# EasyEDA Pro project Altium_Scanning Tunneling Microscope_2023-11-04.eprj

# Schematic 1_ADC

## Sheets
1 1_ADC
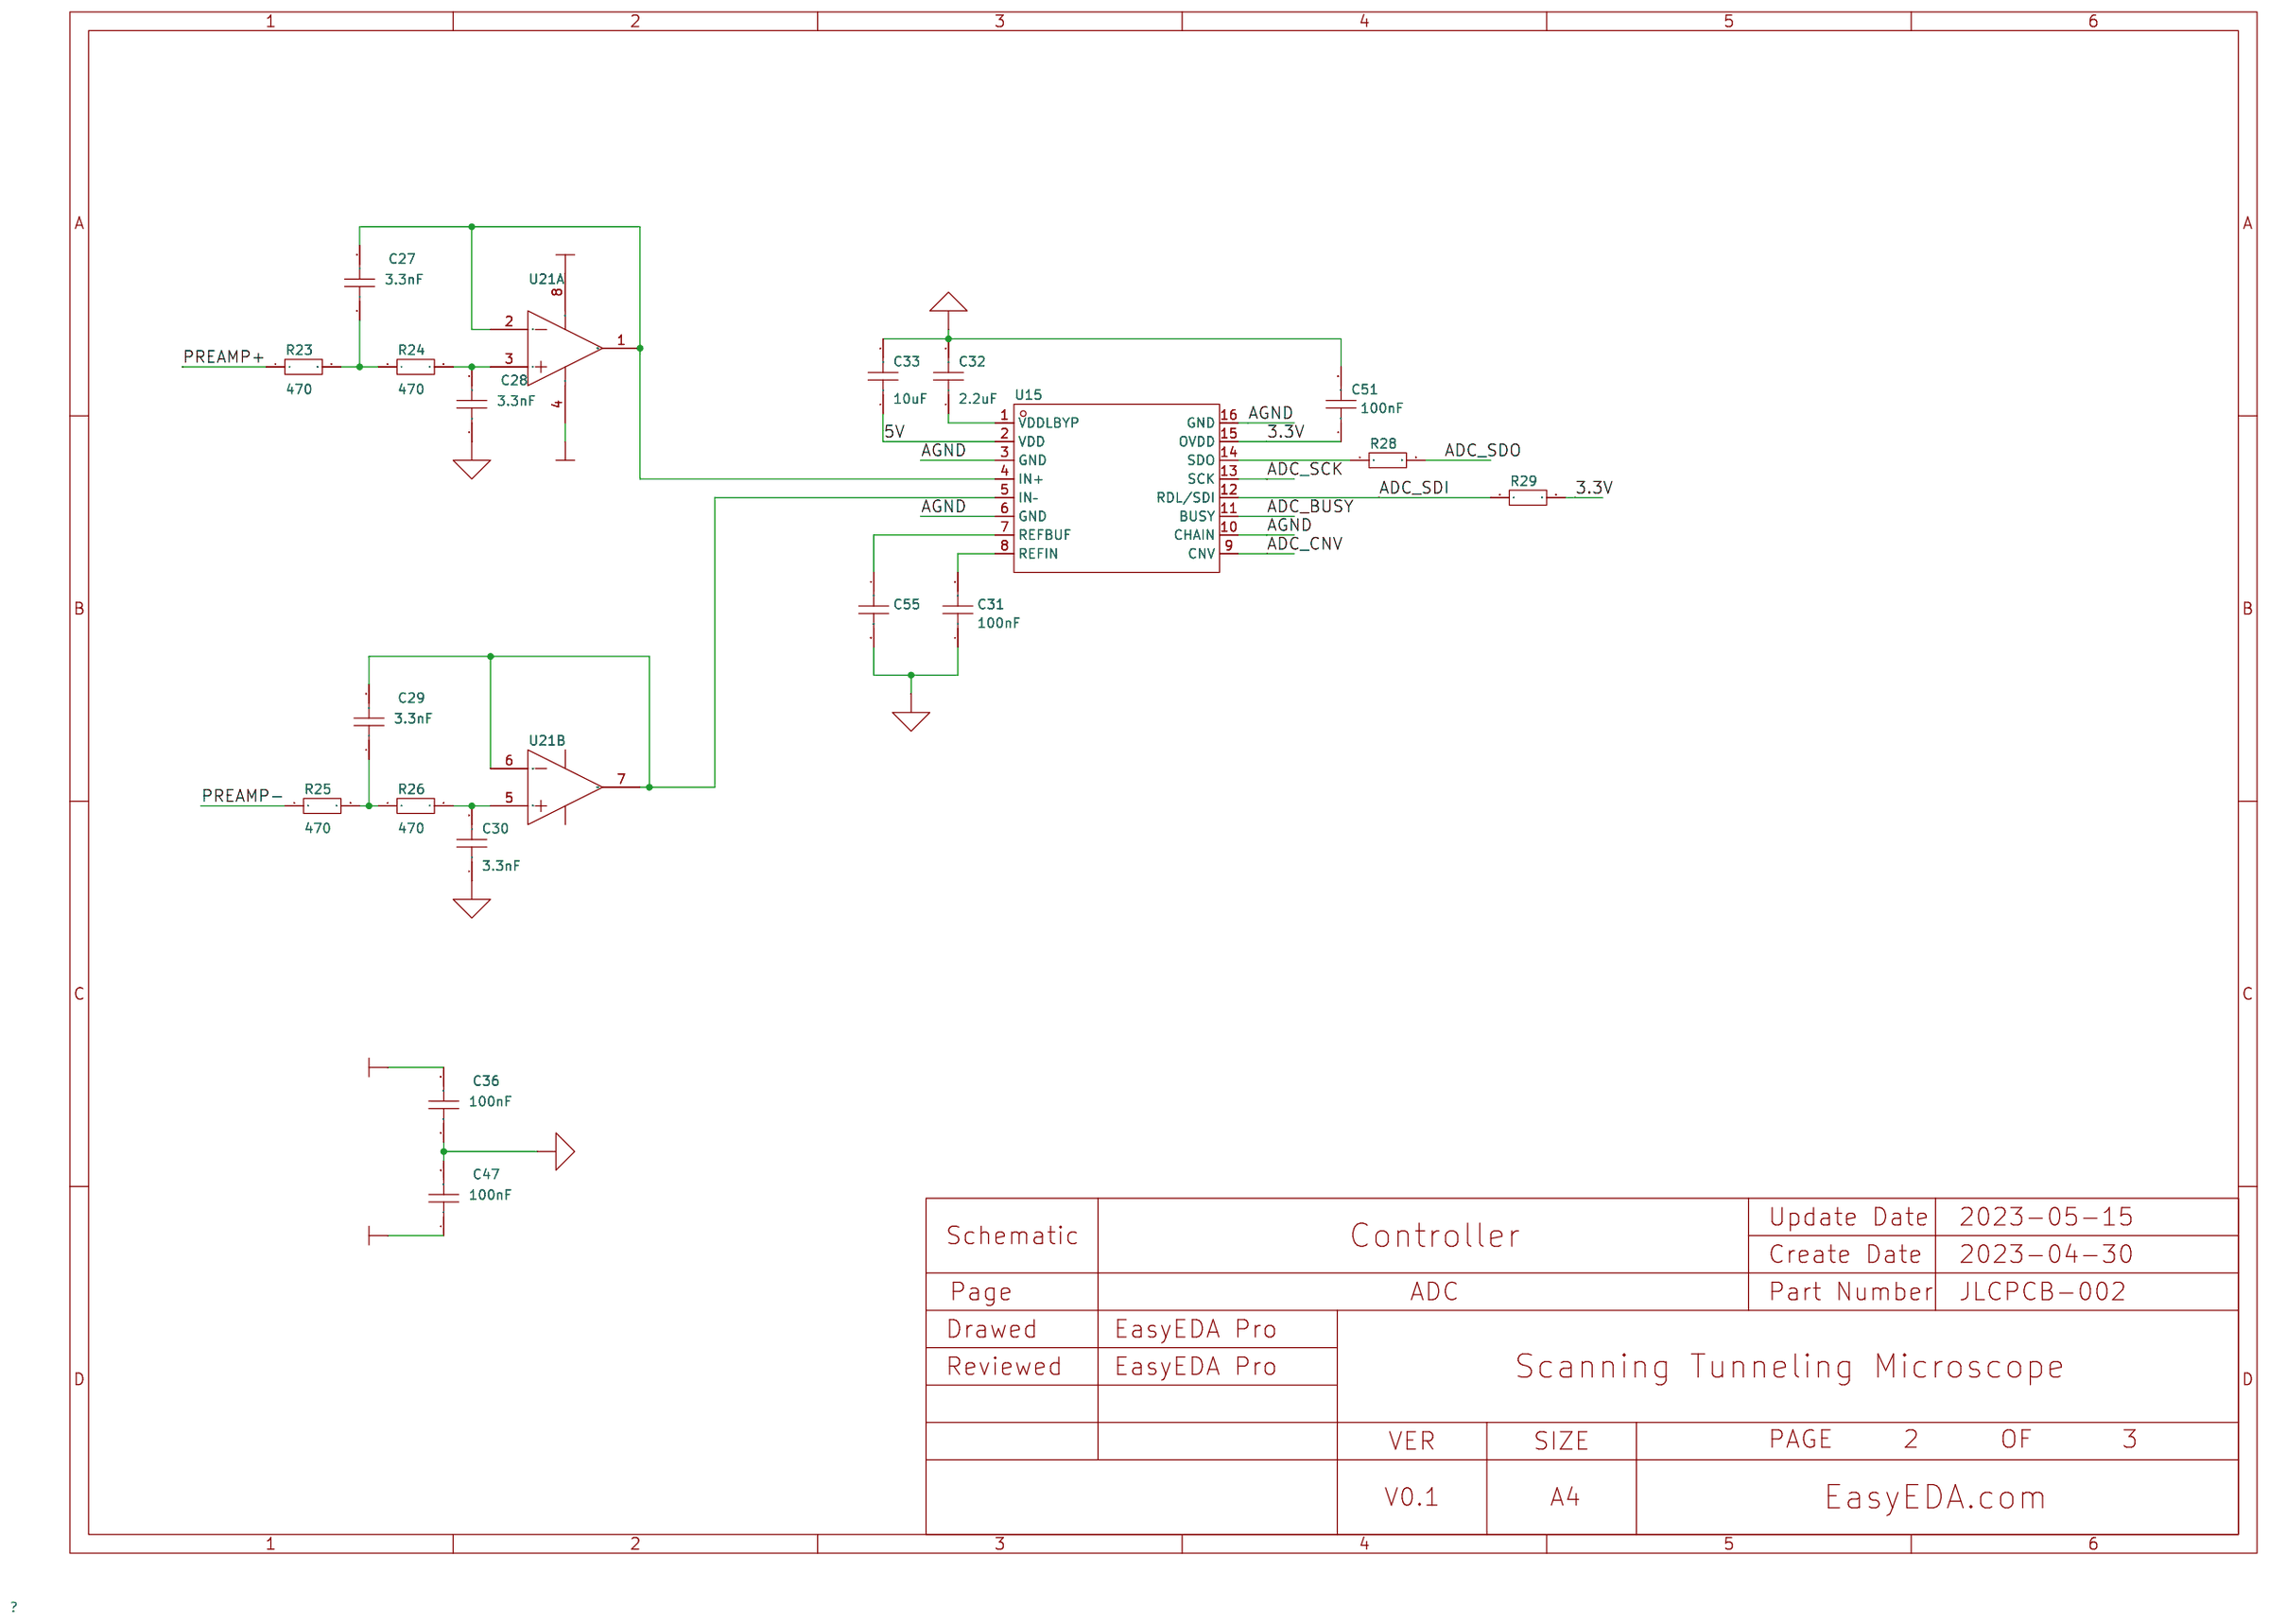
[diagram p0: 1_ADC]
2 2_Connectors
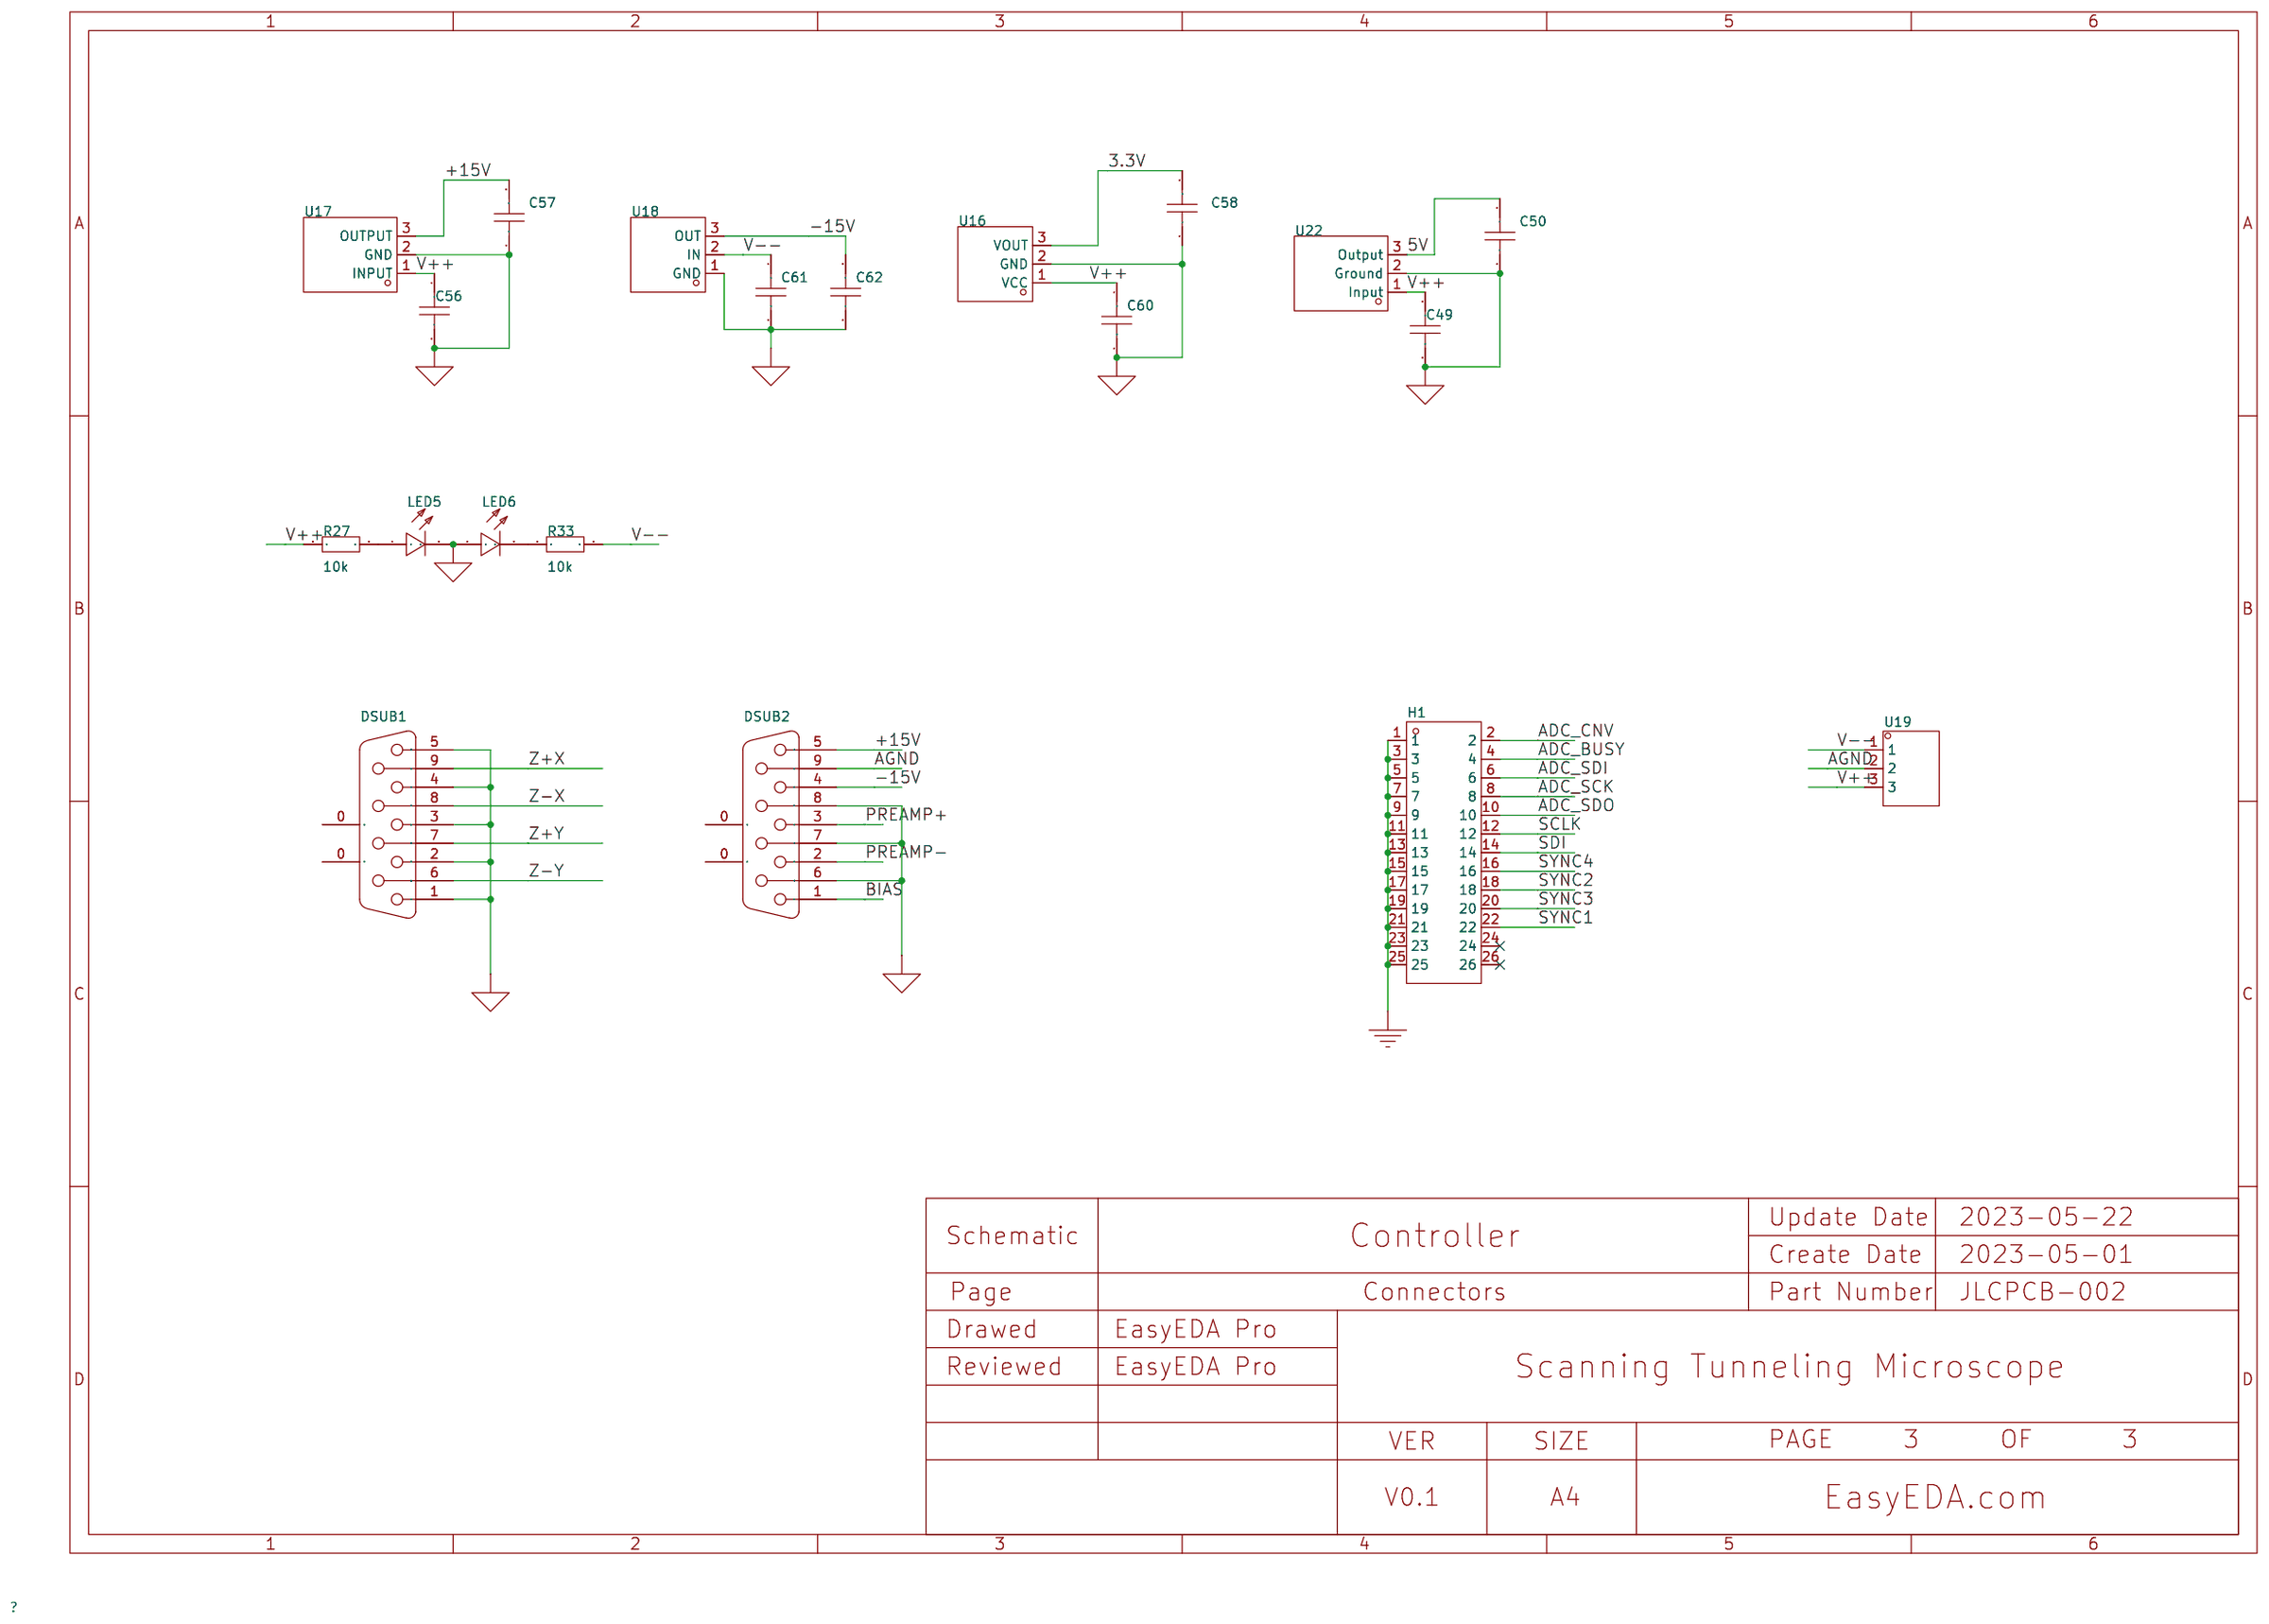
[diagram p1: 2_Connectors]
3 3_DAC
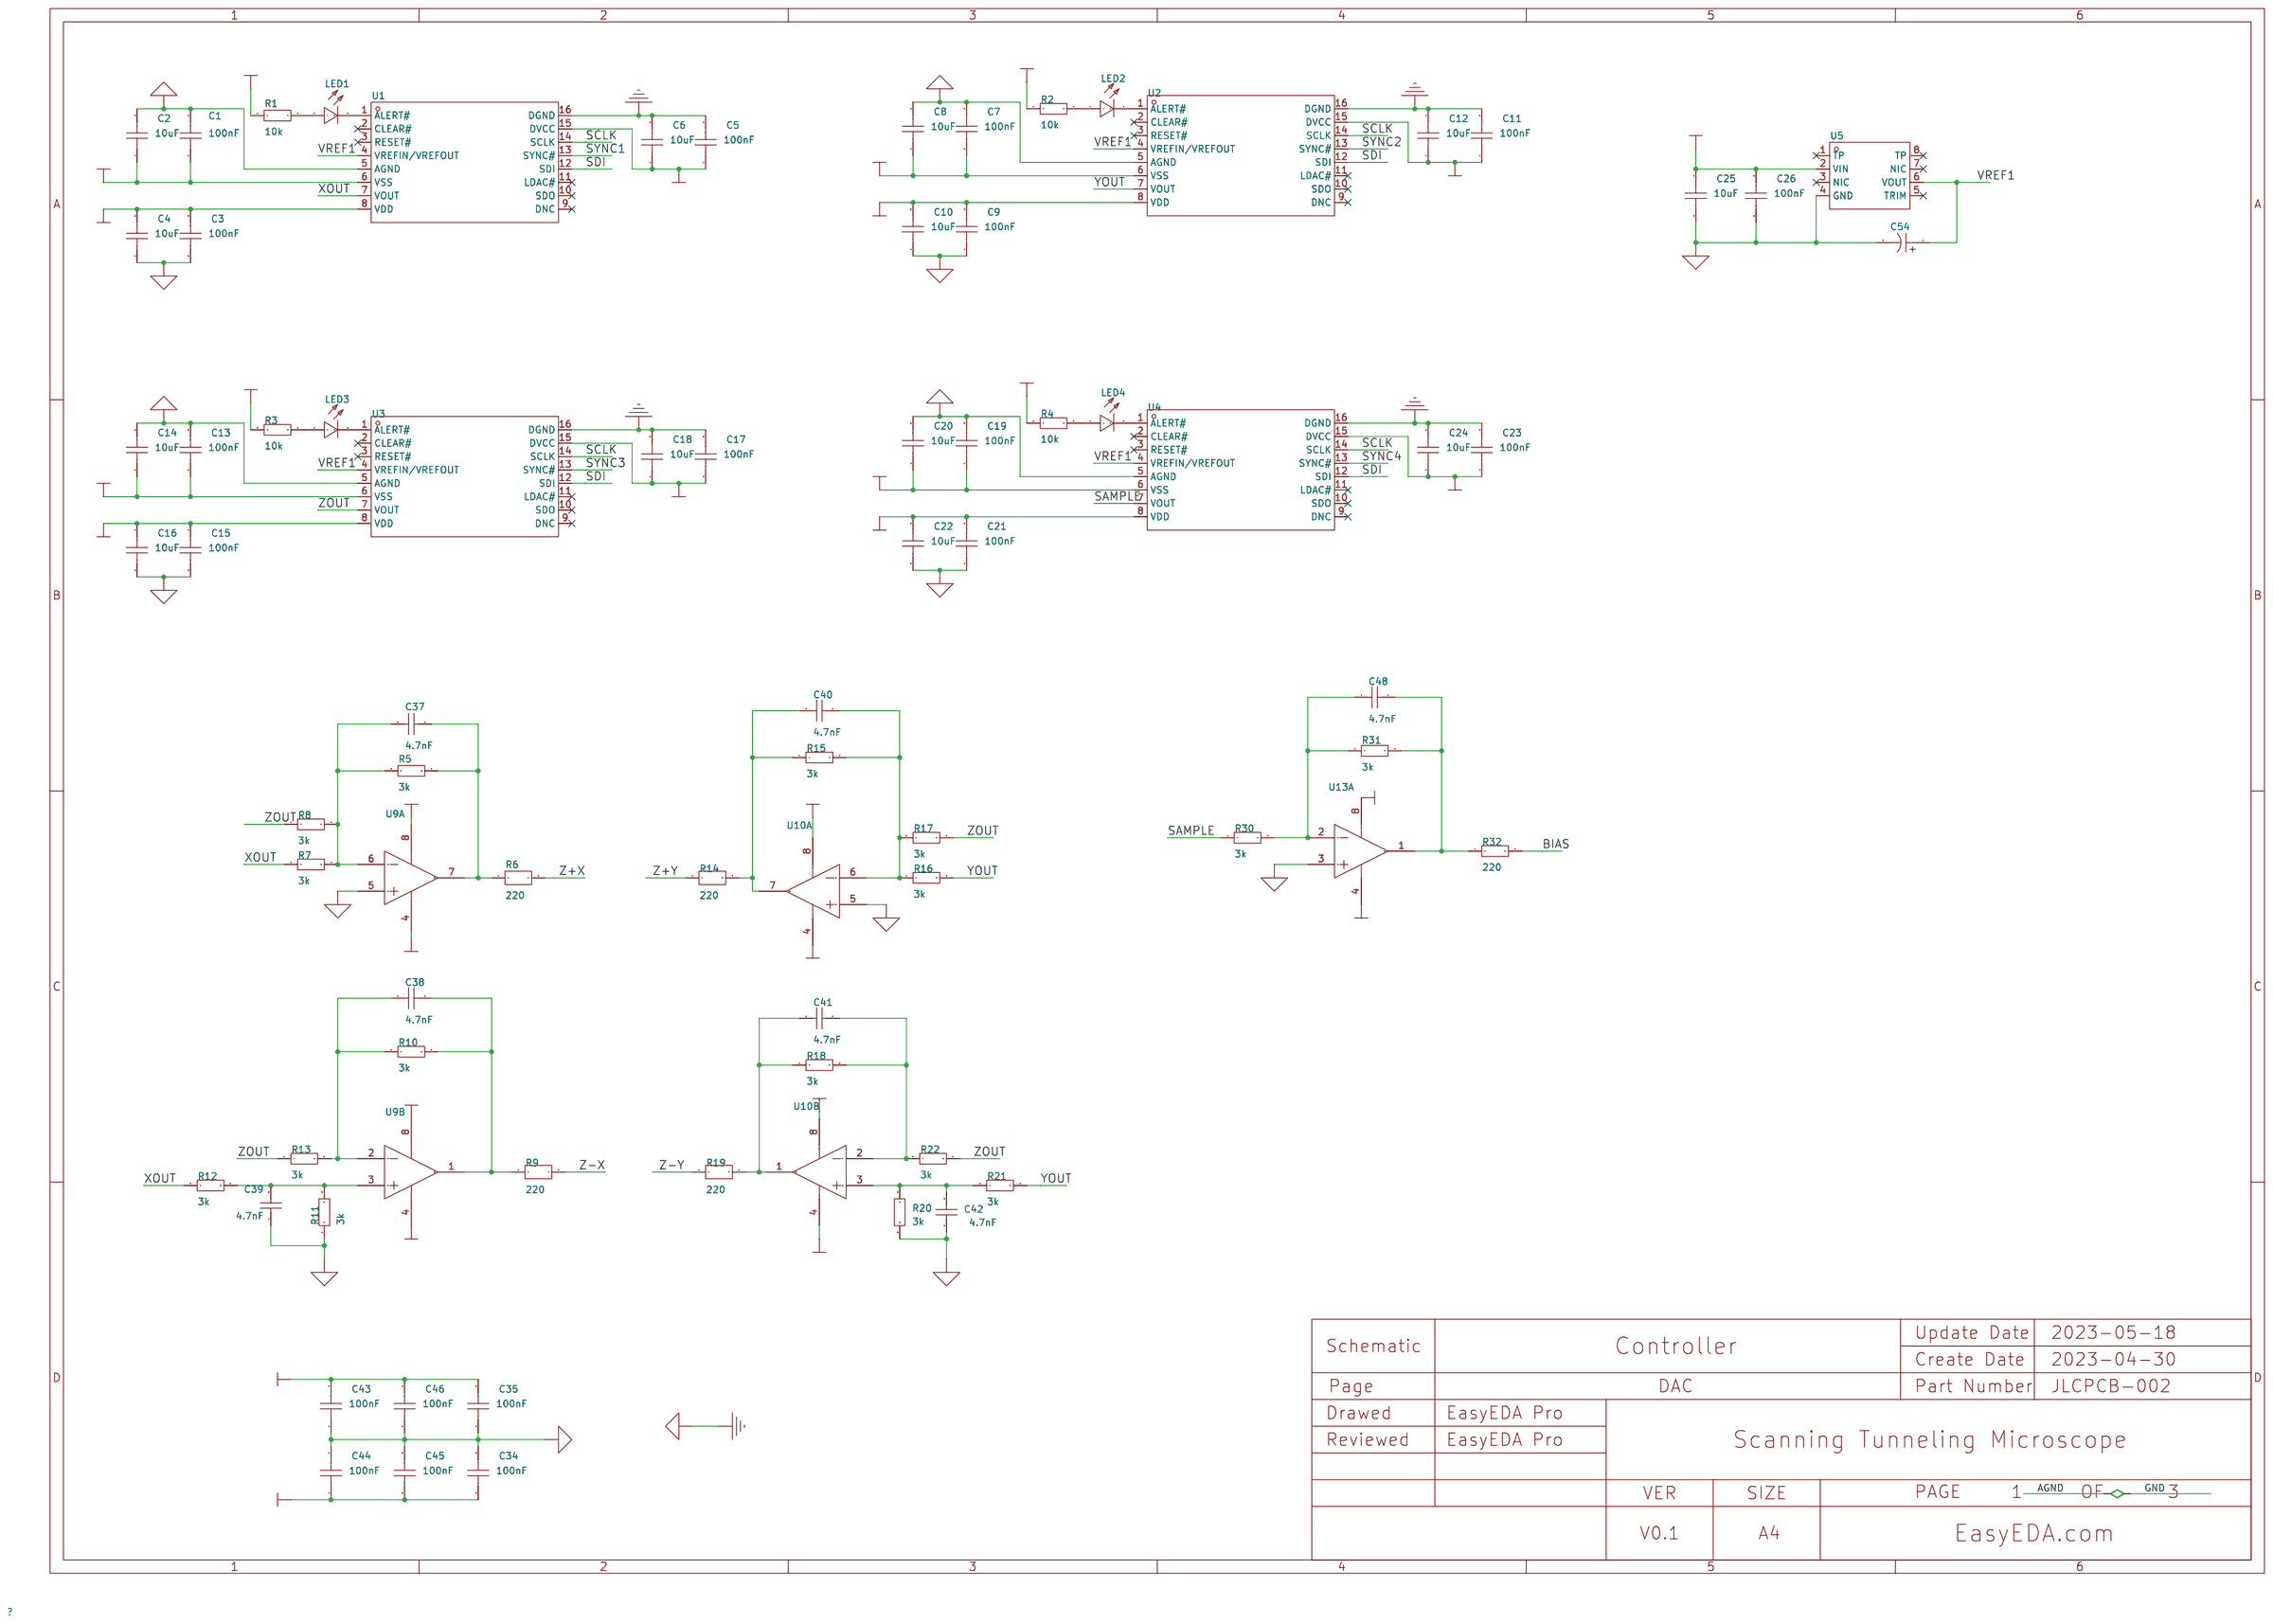
[diagram p2: 3_DAC]

## Parts
sheet 1_ADC
C27  3.3nF  [C0603]
C28  3.3nF  [C0603]
C29  3.3nF  [C0603]
C30  3.3nF  [C0603]
C31  100nF  [C0603]
C32  2.2uF  [C0603]
C33  10uF  [C0603]
C36  100nF  [C0603]
C47  100nF  [C0603]
C51  100nF  [C0603]
C55  47uF  [C1210]
R23  470  [R0603]
R24  470  [R0603]
R25  470  [R0603]
R26  470  [R0603]
R28  100  [R0603]
R29  10K  [R0603]
U15  LTC2326HMS-16#PBF  [MSOP-16_L4.0-W3.0-P0.50-LS4.9-BL]
U21  LT1469IN8#PBF  (sections 1,2)
sheet 2_Connectors
C49  0.33uF  [C0603]
C50  100nF  [C0603]
C56  0.33uF  [C0603]
C57  100nF  [C0603]
C58  1uF  [C0603]
C60  4.7uF  [C0603]
C61  2.2uF  [C0603]
C62  1uF  [C0603]
DSUB1  RDED-9SE-LNA(4-40)(55)  [DSUB-TH_9P-P2.74-S2.84_L18.5-W30.8-M]
DSUB2  RDED-9SE-LNA(4-40)(55)  [DSUB-TH_9P-P2.74-S2.84_L18.5-W30.8-M]
H1  10897262  [HDR-TH_26P-P2.54-V-M-R2-C13-S2.54]
LED5  19-217/R6C-AL1M2VY/3T  [LED0603-R-RD]
LED6  19-217/R6C-AL1M2VY/3T  [LED0603-R-RD]
R27  10k  [R0603]
R33  10k  [R0603]
U16  BD733L5FP-CE2  [TO-252-3L_L6.6-W6.1-P4.60-LS9.5-BR-CW]
U17  SL7815  [TO-220-3_L10.0-W4.5-P2.54-L]
U18  L7915CV  [TO-220-3_L10.0-W4.5-P2.54-L]
U19  B3B-XH-AM(LF)(SN)  [CONN-TH_3P-P2.50_B3B-XH-AM-LF-SN]
U22  MC7805CDTG  [DPAK_L6.6-W6.2-P2.29-LS9.7-BR]
sheet 3_DAC
C1  100nF  [C0603]
C2  10uF  [C0603]
C3  100nF  [C0603]
C4  10uF  [C0603]
C5  100nF  [C0603]
C6  10uF  [C0603]
C7  100nF  [C0603]
C8  10uF  [C0603]
C9  100nF  [C0603]
C10  10uF  [C0603]
C11  100nF  [C0603]
C12  10uF  [C0603]
C13  100nF  [C0603]
C14  10uF  [C0603]
C15  100nF  [C0603]
C16  10uF  [C0603]
C17  100nF  [C0603]
C18  10uF  [C0603]
C19  100nF  [C0603]
C20  10uF  [C0603]
C21  100nF  [C0603]
C22  10uF  [C0603]
C23  100nF  [C0603]
C24  10uF  [C0603]
C25  10uF  [C0603]
C26  100nF  [C0603]
C34  100nF  [C0603]
C35  100nF  [C0603]
C37  4.7nF  [C0603]
C38  4.7nF  [C0603]
C39  4.7nF  [C0603]
C40  4.7nF  [C0603]
C41  4.7nF  [C0603]
C42  4.7nF  [C0603]
C43  100nF  [C0603]
C44  100nF  [C0603]
C45  100nF  [C0603]
C46  100nF  [C0603]
C48  4.7nF  [C0603]
C54  100uF  [CAP-SMD_L7.3-W4.3-FD]
LED1  19-217/R6C-AL1M2VY/3T  [LED0603-R-RD]
LED2  19-217/R6C-AL1M2VY/3T  [LED0603-R-RD]
LED3  19-217/R6C-AL1M2VY/3T  [LED0603-R-RD]
LED4  19-217/R6C-AL1M2VY/3T  [LED0603-R-RD]
R1  10k  [R0603]
R2  10k  [R0603]
R3  10k  [R0603]
R4  10k  [R0603]
R5  3k  [R0603]
R6  220  [R0603]
R7  3k  [R0603]
R8  3k  [R0603]
R9  220  [R0603]
R10  3k  [R0603]
R11  3k  [R0603]
R12  3k  [R0603]
R13  3k  [R0603]
R14  220  [R0603]
R15  3k  [R0603]
R16  3k  [R0603]
R17  3k  [R0603]
R18  3k  [R0603]
R19  220  [R0603]
R20  3k  [R0603]
R21  3k  [R0603]
R22  3k  [R0603]
R30  3k  [R0603]
R31  3k  [R0603]
R32  220  [R0603]
U1  AD5761RBRUZ  [TSSOP-16_L5.0-W4.4-P0.65-LS6.4-TL]
U2  AD5761RBRUZ  [TSSOP-16_L5.0-W4.4-P0.65-LS6.4-TL]
U3  AD5761RBRUZ  [TSSOP-16_L5.0-W4.4-P0.65-LS6.4-TL]
U4  AD5761RBRUZ  [TSSOP-16_L5.0-W4.4-P0.65-LS6.4-TL]
U5  ADR421BRZ-REEL  [SOIC-8_L4.9-W3.9-P1.27-LS6.0-BL]
U9  OPA2227P  (sections 1,2)
U10  OPA2227P  (sections 1,2)
U13  OPA2227P  [PDIP-8_L9.6-W6.4-P2.54-LS7.6-BL]  (section 1)

## Library data of the parts
C1 C3 C5 C7 C9 C11 C13 C15 C17 C19 C21 C23 C26-C36 C43-C47 C51 = CL10B104KA8NNNC: 容值:100nF;精度:±10%;额定电压:25V;温度系数:X7R;; LCSC Part Name: 100nF ±10% 25V; Supplier Part: C1590; Manufacturer: SAMSUNG(三星); Supplier Footprint: 0603; JLCPCB Part Class: Extended Part; Datasheet: https://atta.szlcsc.com/upload/public/pdf/source/20160103/1457707680294.pdf; Supplier: LCSC; Tolerance: ±10%; Voltage Rated: 25V; Temperature Coefficient: X7R
C55 = 47uF: Supplier Footprint: 0603; Origin Footprint 1: CAP_1210
R23-R26 = 470: 电阻类型:厚膜电阻;阻值:10k;精度:±1%;功率:1/10W;温度系数:±100ppm/;最大工作电压:75V;工作温度范围:-55~+155;; Supplier: LCSC; Manufacturer: UniOhm; Manufacturer Part: 0603WAF4700T5E; Supplier Part: C23179; JLCPCB Part Class: Basic Part; Supplier Footprint: 0603; Datasheet: https://atta.szlcsc.com/upload/public/pdf/source/20200306/C422600_1E6D84923E4A46A82E41ADD87F860B5C.pdf; Type: 厚膜电阻; Tolerance: ±1%; Power(Watts): 1/10W; Overload Voltage (Max): 75V; LCSC Part Name: 10k ±1%; Temperature Coefficient: ±100ppm/; Operating Temperature Range: -55~+155
R28 = 100: Supplier Footprint: 0603; Origin Footprint 1: Res_0603
R29 = 10K: Supplier Footprint: 0603; Origin Footprint 1: Res_0603
U15 = LTC2326HMS-16#PBF: Number of Bits:- Sampling Rate (Per Second): Number of Inputs: Input Type: Data Interface: Voltage - Supply: Reference Type:; Supplier Part: C680097; Manufacturer: ADI(亚德诺)/LINEAR; Supplier Footprint: MSOP-16; JLCPCB Part Class: Extended Part; Datasheet: https://atta.szlcsc.com/upload/public/pdf/source/20200722/C680093_F51938300F9263EE407557258EE16CD8.pdf; Supplier: LCSC
U21 = LT1469IN8#PBF: Amplifier Type: Number of Circuits: -3db Bandwidth（G=1）:- Current - Input Bias（Ib）:- Voltage - Input Offset（Vos）:- Gain Bandwidth Product（GBP）: Slew Rate（SR）: Output Type: Supply Voltage（Single）: Iq per channel (Typ): Operating Temperature:; Supplier Part: C663979; Manufacturer: ADI(亚德诺)/LINEAR; Supplier Footprint: PDIP-8; JLCPCB Part Class: Extended Part; Datasheet: https://atta.szlcsc.com/upload/public/pdf/source/20200713/C663973_E2E2AEA39F825CAB8624C89850E5F618.pdf; Supplier: LCSC; Origin Footprint 2: PDIP-8_L10.2-W6.5-P2.54-LS7.6-BL
C49 C56 = 0.33uF: Supplier Footprint: 0603; Origin Footprint 1: CAP_0603
C50 C57 = 100nF: Supplier Footprint: 0603; Origin Footprint 1: CAP_0603
C58 C62 = 1uF: Supplier Footprint: 0603; Origin Footprint 1: CAP_0603
C60 = 4.7uF: Supplier Footprint: 0603; Origin Footprint 1: CAP_0603
C61 = 2.2uF: Supplier Footprint: 0603; Origin Footprint 1: CAP_0603
DSUB1 DSUB2 = RDED-9SE-LNA(4-40)(55): Supplier Part: C324990; Manufacturer: HRS(广濑); JLCPCB Part Class: Extended Part; Datasheet: https://atta.szlcsc.com/upload/public/pdf/source/20181031/C324990_1C30430775BD778D10633A35FD38E859.pdf; Supplier: LCSC
H1 = 10897262: Pitch:2.54mm Number of Pins:26 Number of Rows: Pin Structure:2x13P Row Spacing:2.54mm Mounting Type:Straight Circluar Pins/Square Pins:Square Pins Current Rating (Max):- Voltage Rating (Max):- Length of Mating Pin:6.1mm Insulation Height:2.29mm Length of; LCSC Part Name: 2.54mm 2x13P 直插 方针; Supplier Part: C586270; Manufacturer: MOLEX; Supplier Footprint: 直插,P=2.54mm; JLCPCB Part Class: Extended Part; Datasheet: https://atta.szlcsc.com/upload/public/pdf/source/20200716/C585622_346B36A4E49C3AB4BB06E0932C7001B0.pdf; Supplier: LCSC; Pitch: 2.54mm; Number of Pins: 26; Pin Structure: 2x13P; Row Spacing: 2.54mm; Mounting Type: Straight; Circluar Pins/Square Pins: Square Pins; Length of Mating Pin: 6.1mm; Insulation Height: 2.29mm
LED1-LED6 = 19-217/R6C-AL1M2VY/3T: 发光颜色:红灯;二极管配置:-;透镜颜色:无色透明;主波长:617.5nm;峰值波长:632nm;色温:-;光通量(25时):-;测试电流:5mA;正向电压(VF):2.2V;发光强度:28.5mcd;功率:60mW;发光角度:120°;安装方式:-;工作温度:-40~+85;; LCSC Part Name: 0603 红灯; Supplier Part: C72044; Manufacturer: EVERLIGHT(台湾亿光); Supplier Footprint: 0603; JLCPCB Part Class: Extended Part; Datasheet: https://atta.szlcsc.com/upload/public/pdf/source/20160507/1462613613821.pdf; Supplier: LCSC; Emitted Color: 红灯; Lens Color: 无色透明; Dominant Wavelength: 617.5nm; Peak Wavelength: 632nm; Forward Current: 5mA; Forward Voltage (VF): 2.2V; Luminous Intensity: 28.5mcd; Power Dissipation: 60mW; Viewing Angle: 120°; Operating Temperature: -40~+85
R1-R4 R27 R33 = 0603WAF1002T5E: 电阻类型:厚膜电阻;阻值:10k;精度:±1%;功率:1/10W;温度系数:±100ppm/;最大工作电压:75V;工作温度范围:-55~+155;; LCSC Part Name: 10k ±1%; Supplier Part: C25804; Manufacturer: UNI-ROYAL(厚声); Supplier Footprint: 0603; JLCPCB Part Class: Basic Part; Datasheet: https://atta.szlcsc.com/upload/public/pdf/source/20200306/C422600_1E6D84923E4A46A82E41ADD87F860B5C.pdf; Supplier: LCSC; Type: 厚膜电阻; Tolerance: ±1%; Power(Watts): 1/10W; Temperature Coefficient: ±100ppm/; Overload Voltage (Max): 75V; Operating Temperature Range: -55~+155
U16 = BD733L5FP-CE2: Supplier Part: C509724; Manufacturer: ROHM(罗姆); Supplier Footprint: TO-252-3; JLCPCB Part Class: Extended Part; Datasheet: https://atta.szlcsc.com/upload/public/pdf/source/20230201/396DA52F76B265AFAA10405709CD3C0A.pdf; Supplier: LCSC
U17 = SL7815: Output Type: Output Polarity:Positive Number of Outputs:1 Maximum Input Voltage:30V Output Voltage:15V~15V Output Voltage:15V~15V Dropout Voltage:2V@(500mA) Output Current:1A Power Supply Rejection Ratio (PSRR):70dB@(120Hz); LCSC Part Name: 正 Vin=30V Vout=15V 1A 70dB@(120Hz); Supplier Part: C458979; Manufacturer: Slkor(萨科微); Supplier Footprint: TO-220; JLCPCB Part Class: Extended Part; Datasheet: https://atta.szlcsc.com/upload/public/pdf/source/20191121/C458979_7C045E8EA06C0BC569B49C0292DDB5EB.pdf; Supplier: LCSC; Output Polarity: Positive; Number of Outputs: 1; Maximum Input Voltage: 30V; Output Voltage: 15V~15V; Dropout Voltage: 2V@(500mA); Output Current: 1A; Power Supply Rejection Ratio (PSRR): 70dB@(120Hz)
U18 = L7915CV: Output Type: Output Polarity:Negative Number of Outputs:1 Maximum Input Voltage:35V Output Voltage:15V~15V Output Voltage:15V~15V Dropout Voltage:1.1V@(1A) Output Current:1.5A Power Supply Rejection Ratio (PSRR):60dB@(120Hz); Supplier Part: C154950; Manufacturer: ST(意法半导体); Supplier Footprint: TO-220; JLCPCB Part Class: Extended Part; Datasheet: https://atta.szlcsc.com/upload/public/pdf/source/20180301/C154950_15198941423711383385.pdf; Supplier: LCSC; Output Polarity: Negative; Number of Outputs: 1; Maximum Input Voltage: 35V; Output Voltage: 15V~15V; Dropout Voltage: 1.1V@(1A); Output Current: 1.5A; Power Supply Rejection Ratio (PSRR): 60dB@(120Hz)
U19 = B3B-XH-AM(LF)(SN): Reference Series:XH Pitch:2.5mm Pins Structure:1x3P Number of Rows:1 Number of PINs Per Row:3 Row Spacing:- Mounting Style:- Contact Material:Brass; LCSC Part Name: XH 2.5mm 1x3P; Supplier Part: C161870; Manufacturer: JST; Supplier Footprint: 插件,P=2.5mm; JLCPCB Part Class: Extended Part; Datasheet: https://atta.szlcsc.com/upload/public/pdf/source/20180531/C161870_3E9DCF0B047693C204E35D1E5FF841C1.pdf; Supplier: LCSC; Reference Series: XH; Pitch: 2.5mm; Pins Structure: 1x3P; Number of Rows: 1; Number of PINs Per Row: 3; Contact Material: Brass
U22 = MC7805CDTG: LCSC Part Name: 线性电压稳压器，1 A，5 至 24 V，正向; Supplier Part: C897464; Manufacturer: onsemi(安森美); Supplier Footprint: DPAK; JLCPCB Part Class: Extended Part; Datasheet: https://atta.szlcsc.com/upload/public/pdf/source/20221020/B822C9350C81A84B74CC7C0C15A8E182.pdf; Supplier: LCSC
C2 C4 C6 C8 C10 C12 C14 C16 C18 C20 C22 C24 C25 = GRM188R61E106MA73D: 容值:10uF;精度:±20%;额定电压:25V;温度系数:X5R;; LCSC Part Name: 10uF ±20% 25V; Supplier Part: C91606; Manufacturer: muRata(村田); Supplier Footprint: 0603; JLCPCB Part Class: Extended Part; Datasheet: https://atta.szlcsc.com/upload/public/pdf/source/20161226/1482720176185.pdf; Supplier: LCSC; Tolerance: ±20%; Voltage Rated: 25V; Temperature Coefficient: X5R
C37-C42 C48 = 0603B472K500NT: 容值:4.7nF;精度:±10%;额定电压:50V;温度系数:X7R;; LCSC Part Name: 4.7nF ±10% 50V; Supplier Part: C53987; Manufacturer: FH(风华); Supplier Footprint: 0603; JLCPCB Part Class: Basic Part; Datasheet: https://atta.szlcsc.com/upload/public/pdf/source/20170923/C53987_1506149489951988835.pdf; Supplier: LCSC; Tolerance: ±10%; Voltage Rated: 50V; Temperature Coefficient: X7R
C54 = 100uF: Capacitance: Tolerance:±20% Tolerance:±20% Rated Voltage: Leakage Current(DCL):- Ripple Current:- Equivalent Series Resistance(ESR):500mΩ@100kHz Operating Temperature:-55℃~+125℃ Operating Temperature:-55℃~+125℃; LCSC Part Name: 100uF ±20% 20V; Supplier Part: C1870833; Manufacturer: Kyocera AVX; Manufacturer Part: F931D107MNC; Supplier Footprint: 2917; JLCPCB Part Class: Extended Part; Supplier: LCSC; Tolerance: ±20%; Equivalent Series Resistance(ESR): 500mΩ@100kHz; Operating Temperature: -55℃~+125℃; Origin Footprint 1: F931D107MNC
R5 R7 R8 R10-R13 R15-R18 R20-R22 R30-R32 = ARG03DTC3001: 电阻类型:薄膜电阻;阻值:3k;精度:±0.5%;功率:100mW;温度系数:±25ppm/;最大工作电压:75V;工作温度范围:-55~+155;; LCSC Part Name: 3k ±0.5% 100mW; Supplier Part: C311916; Manufacturer: 光颉(Viking); Supplier Footprint: 0603; JLCPCB Part Class: Extended Part; Datasheet: https://atta.szlcsc.com/upload/public/pdf/source/20181119/C311916_083AB72433BF5B624DBE6C035DD51480.pdf; Supplier: LCSC; Type: 薄膜电阻; Tolerance: ±0.5%; Power(Watts): 100mW; Temperature Coefficient: ±25ppm/; Overload Voltage (Max): 75V; Operating Temperature Range: -55~+155
R6 R9 R14 R19 = ERJU3RD2200V: 阻值:220;精度:±0.5%;功率:100mW;温度系数:±50ppm/;最大工作电压:-;工作温度范围:-55~+155;; LCSC Part Name: 220 ±0.5% 100mW; Supplier Part: C491169; Manufacturer: PANASONIC(松下); Supplier Footprint: 0603; JLCPCB Part Class: Extended Part; Datasheet: https://atta.szlcsc.com/upload/public/pdf/source/20200407/C491169_AC2E94AF70820CF85EC0143B46F9F0DA.pdf; Supplier: LCSC; Tolerance: ±0.5%; Power(Watts): 100mW; Temperature Coefficient: ±50ppm/; Operating Temperature Range: -55~+155
U1-U4 = AD5761RBRUZ: D/A 位数:-;D/A通道数:-;输出类型:-;读写接口类型:-;; Supplier Part: C404015; Manufacturer: ADI(亚德诺)/LINEAR; Supplier Footprint: TSSOP-16; JLCPCB Part Class: Extended Part; Datasheet: https://atta.szlcsc.com/upload/public/pdf/source/20190722/C404015_21C88E48C88813C7B0010A18F7ED8816.pdf; Supplier: LCSC
U5 = ADR421BRZ-REEL: Supplier Part: C496503; Manufacturer: ADI(亚德诺)/LINEAR; Supplier Footprint: SOIC-8; JLCPCB Part Class: Extended Part; Datasheet: https://atta.szlcsc.com/upload/public/pdf/source/20200316/C496503_A1F080746FA87D9455D96FF2B5AA62EC.pdf; Supplier: LCSC
U9 U10 = OPA2227P: 运放类型:General Purpose;放大器组数:2;增益带宽积（GBP）:8MHz;压摆率（SR）:2.3 V/us;电源电压:5V ~ 36V, ±2.5V ~ 18V;各通道供电电流:3.7mA;; Supplier Part: C1346534; Manufacturer: TI(德州仪器); Supplier Footprint: PDIP-8; JLCPCB Part Class: Extended Part; Datasheet: https://atta.szlcsc.com/upload/public/pdf/source/20210702/51099E56FC087785D4CD98B058FDBA2E.pdf; Supplier: LCSC; Amplifier Type: General Purpose; Number of Circuits: 2; Gain Bandwidth Product（GBP）: 8MHz; Slew Rate（SR）: 2.3 V/us; Supply Voltage（Single）: 5V ~ 36V, ±2.5V ~ 18V; Iq per channel (Typ): 3.7mA; Origin Footprint 2: PDIP-8_L9.6-W6.4-P2.54-LS7.6-BL
U13 = OPA2227P: Supplier Part: C1346534; Manufacturer: TI(德州仪器); Supplier Footprint: PDIP-8; JLCPCB Part Class: Extended Part; Datasheet: https://atta.szlcsc.com/upload/public/pdf/source/20210702/51099E56FC087785D4CD98B058FDBA2E.pdf; Supplier: LCSC

## Nets
3.3V: C5.1 C6.1 C11.1 C12.1 C17.1 C18.1 C23.1 C24.1 C51.1 C58.2 R1.1 R2.1 R3.1 R4.1 R29.2 U1.15(DVCC) U2.15(DVCC) U3.15(DVCC) U4.15(DVCC) U15.15(OVDD) U16.3(VOUT)
5V: C33.1 C50.2 U15.2(VDD) U22.3(Output)
+15V: C3.2 C4.2 C9.2 C10.2 C15.2 C16.2 C21.2 C22.2 C25.2 C26.2 C35.2 C36.2 C43.2 C46.2 C57.2 DSUB2.5 U1.8(VDD) U2.8(VDD) U3.8(VDD) U4.8(VDD) U5.2(VIN) U9.8(V+) U10.8(V+) U13.8(V+) U17.3(OUTPUT) U21.8(V+)
-15V: C1.1 C2.1 C7.1 C8.1 C13.1 C14.1 C19.1 C20.1 C34.1 C44.1 C45.1 C47.1 C62.2 DSUB2.4 U1.6(VSS) U2.6(VSS) U3.6(VSS) U4.6(VSS) U9.4(V-) U10.4(V-) U13.4(V-) U18.3(OUT) U21.4(V-)
AGND: C1.2 C2.2 C3.1 C4.1 C5.2 C6.2 C7.2 C8.2 C9.1 C10.1 C11.2 C12.2 C13.2 C14.2 C15.1 C16.1 C17.2 C18.2 C19.2 C20.2 C21.1 C22.1 C23.2 C24.2 C25.1 C26.1 C28.1 C30.1 C31.1 C32.2 C33.2 C34.2 C35.1 C36.1 C39.1 C42.2 C43.1 C44.2 C45.2 C46.1 C47.2 C49.2 C50.1 C51.2 C54.2 C55.2 C56.2 C57.1 C58.1 C60.2 C61.2 C62.1 DSUB1.1 DSUB1.2 DSUB1.3 DSUB1.4 DSUB1.5 DSUB2.6 DSUB2.7 DSUB2.8 DSUB2.9 H1.1 H1.3 H1.5 H1.7 H1.9 H1.11 H1.13 H1.15 H1.17 H1.19 H1.21 H1.23 H1.25 LED5.2(C) LED6.1(A) R11.1 R20.2 U1.5(AGND) U1.16(DGND) U2.5(AGND) U2.16(DGND) U3.5(AGND) U3.16(DGND) U4.5(AGND) U4.16(DGND) U5.4(GND) U9.5(IN B+) U10.5(IN B+) U13.3(INA+) U15.3(GND) U15.6(GND) U15.10(CHAIN) U15.16(GND) U16.2(GND) U17.2(GND) U18.1(GND) U19.2 U22.2(Ground)
ADC_BUSY: H1.4 U15.11(BUSY)
ADC_CNV: H1.2 U15.9(CNV)
ADC_SCK: H1.8 U15.13(SCK)
ADC_SDI: H1.6 R29.1 U15.12(RDL/SDI)
ADC_SDO: H1.10 R28.2
BIAS: DSUB2.1 R32.2
PREAMP+: DSUB2.3 R23.1
PREAMP-: DSUB2.2 R25.1
SAMPLE: R30.1 U4.7(VOUT)
SCLK: H1.12 U1.14(SCLK) U2.14(SCLK) U3.14(SCLK) U4.14(SCLK)
SDI: H1.14 U1.12(SDI) U2.12(SDI) U3.12(SDI) U4.12(SDI)
SYNC1: H1.22 U1.13(SYNC#)
SYNC2: H1.18 U2.13(SYNC#)
SYNC3: H1.20 U3.13(SYNC#)
SYNC4: H1.16 U4.13(SYNC#)
V++: C49.1 C56.1 C60.1 R27.1 U16.1(VCC) U17.1(INPUT) U19.3 U22.1(Input)
V--: C61.1 R33.2 U18.2(IN) U19.1
VREF1: C54.1 U1.4(VREFIN/VREFOUT) U2.4(VREFIN/VREFOUT) U3.4(VREFIN/VREFOUT) U4.4(VREFIN/VREFOUT) U5.6(VOUT)
XOUT: R7.1 R12.1 U1.7(VOUT)
YOUT: R16.2 R21.2 U2.7(VOUT)
Z+X: DSUB1.9 R6.2
Z+Y: DSUB1.7 R14.1
Z-X: DSUB1.8 R9.2
Z-Y: DSUB1.6 R19.1
ZOUT: R8.1 R13.1 R17.2 R22.2 U3.7(VOUT)
$1N8441: LED2.2(C) U2.1(ALERT#)
$1N8442: LED2.1(A) R2.2
$1N8455: LED1.2(C) U1.1(ALERT#)
$1N8456: LED1.1(A) R1.2
$1N8468: LED4.2(C) U4.1(ALERT#)
$1N8469: LED4.1(A) R4.2
$1N8482: LED3.2(C) U3.1(ALERT#)
$1N8483: LED3.1(A) R3.2
$1N8501: C37.2 R5.2 R6.1 U9.7(OUT B)
$1N8502: C37.1 R5.1 R7.2 R8.2 U9.6(IN B-)
$1N8511: C40.1 R14.2 R15.1 U10.7(OUT B)
$1N8512: C40.2 R15.2 R16.1 R17.1 U10.6(IN B-)
$1N8517: C41.1 R18.1 R19.2 U10.1(OUT A)
$1N8518: C41.2 R18.2 R22.1 U10.2(IN A-)
$1N8520: C42.1 R20.1 R21.1 U10.3(IN A+)
$1N8548: C38.1 R10.1 R13.2 U9.2(IN A-)
$1N8549: C38.2 R9.1 R10.2 U9.1(OUT A)
$1N8550: C39.2 R11.2 R12.2 U9.3(IN A+)
$1N30800: C48.1 R30.2 R31.1 U13.2(INA-)
$1N31013: C48.2 R31.2 R32.1 U13.1(OUTA)
$2N10171: C27.1 R23.2 R24.1
$2N10177: C27.2 U15.4(IN+) U21.1(OUT A) U21.2(-IN A)
$2N10196: C28.2 R24.2 U21.3(+IN A)
$2N10488: C29.1 R25.2 R26.1
$2N10490: C30.2 R26.2 U21.5(+IN B)
$2N12917: C55.1 U15.7(REFBUF)
$2N12918: C31.2 U15.8(REFIN)
$2N13335: C29.2 U15.5(IN–) U21.6(-IN B) U21.7(OUT B)
$2N14080: C32.1 U15.1(VDDLBYP)
$2N15362: R28.1 U15.14(SDO)
$3N8511: LED5.1(A) R27.2
$3N8729: LED6.2(C) R33.1

Not connected (* = marked no-connect by the designer): DSUB1 0; DSUB2 0; H1 24* 26*; U1 2(CLEAR#)* 3(RESET#)* 9(DNC)* 10(SDO)* 11(LDAC#)*; U2 2(CLEAR#)* 3(RESET#)* 9(DNC)* 10(SDO)* 11(LDAC#)*; U3 2(CLEAR#)* 3(RESET#)* 9(DNC)* 10(SDO)* 11(LDAC#)*; U4 2(CLEAR#)* 3(RESET#)* 9(DNC)* 10(SDO)* 11(LDAC#)*; U5 1(TP)* 3(NIC)* 5(TRIM)* 7(NIC)* 8(TP)*

# Board PCB1
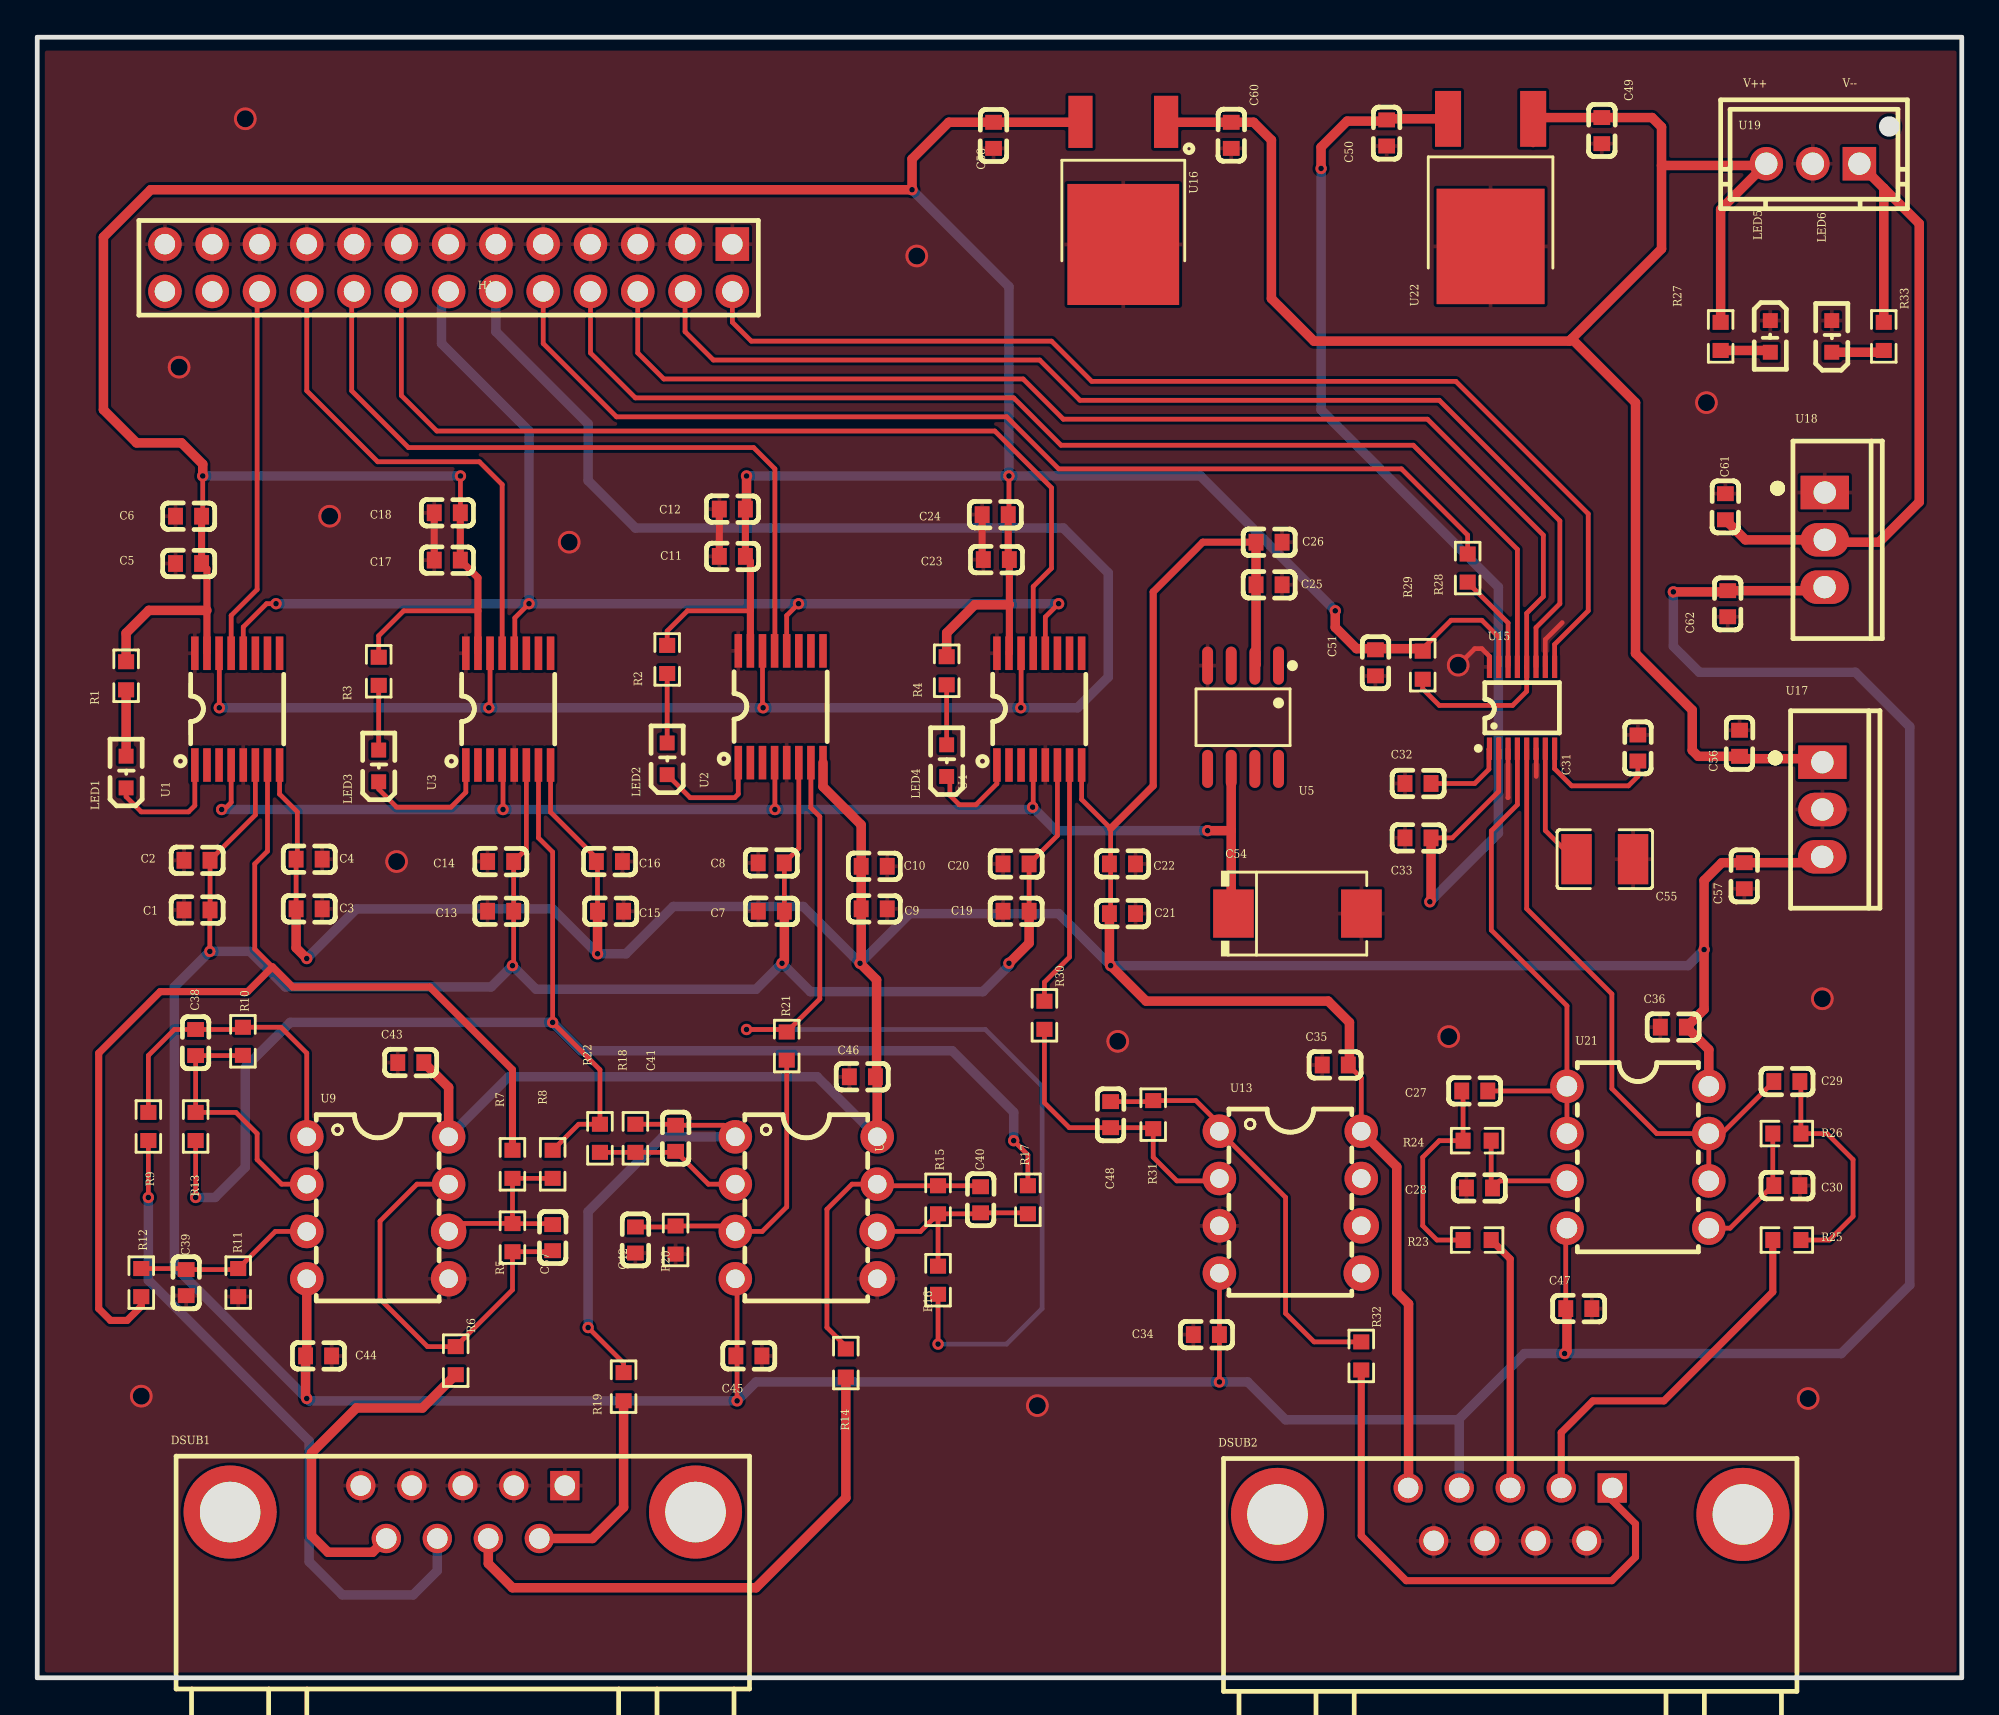
[diagram p3: board, top side]
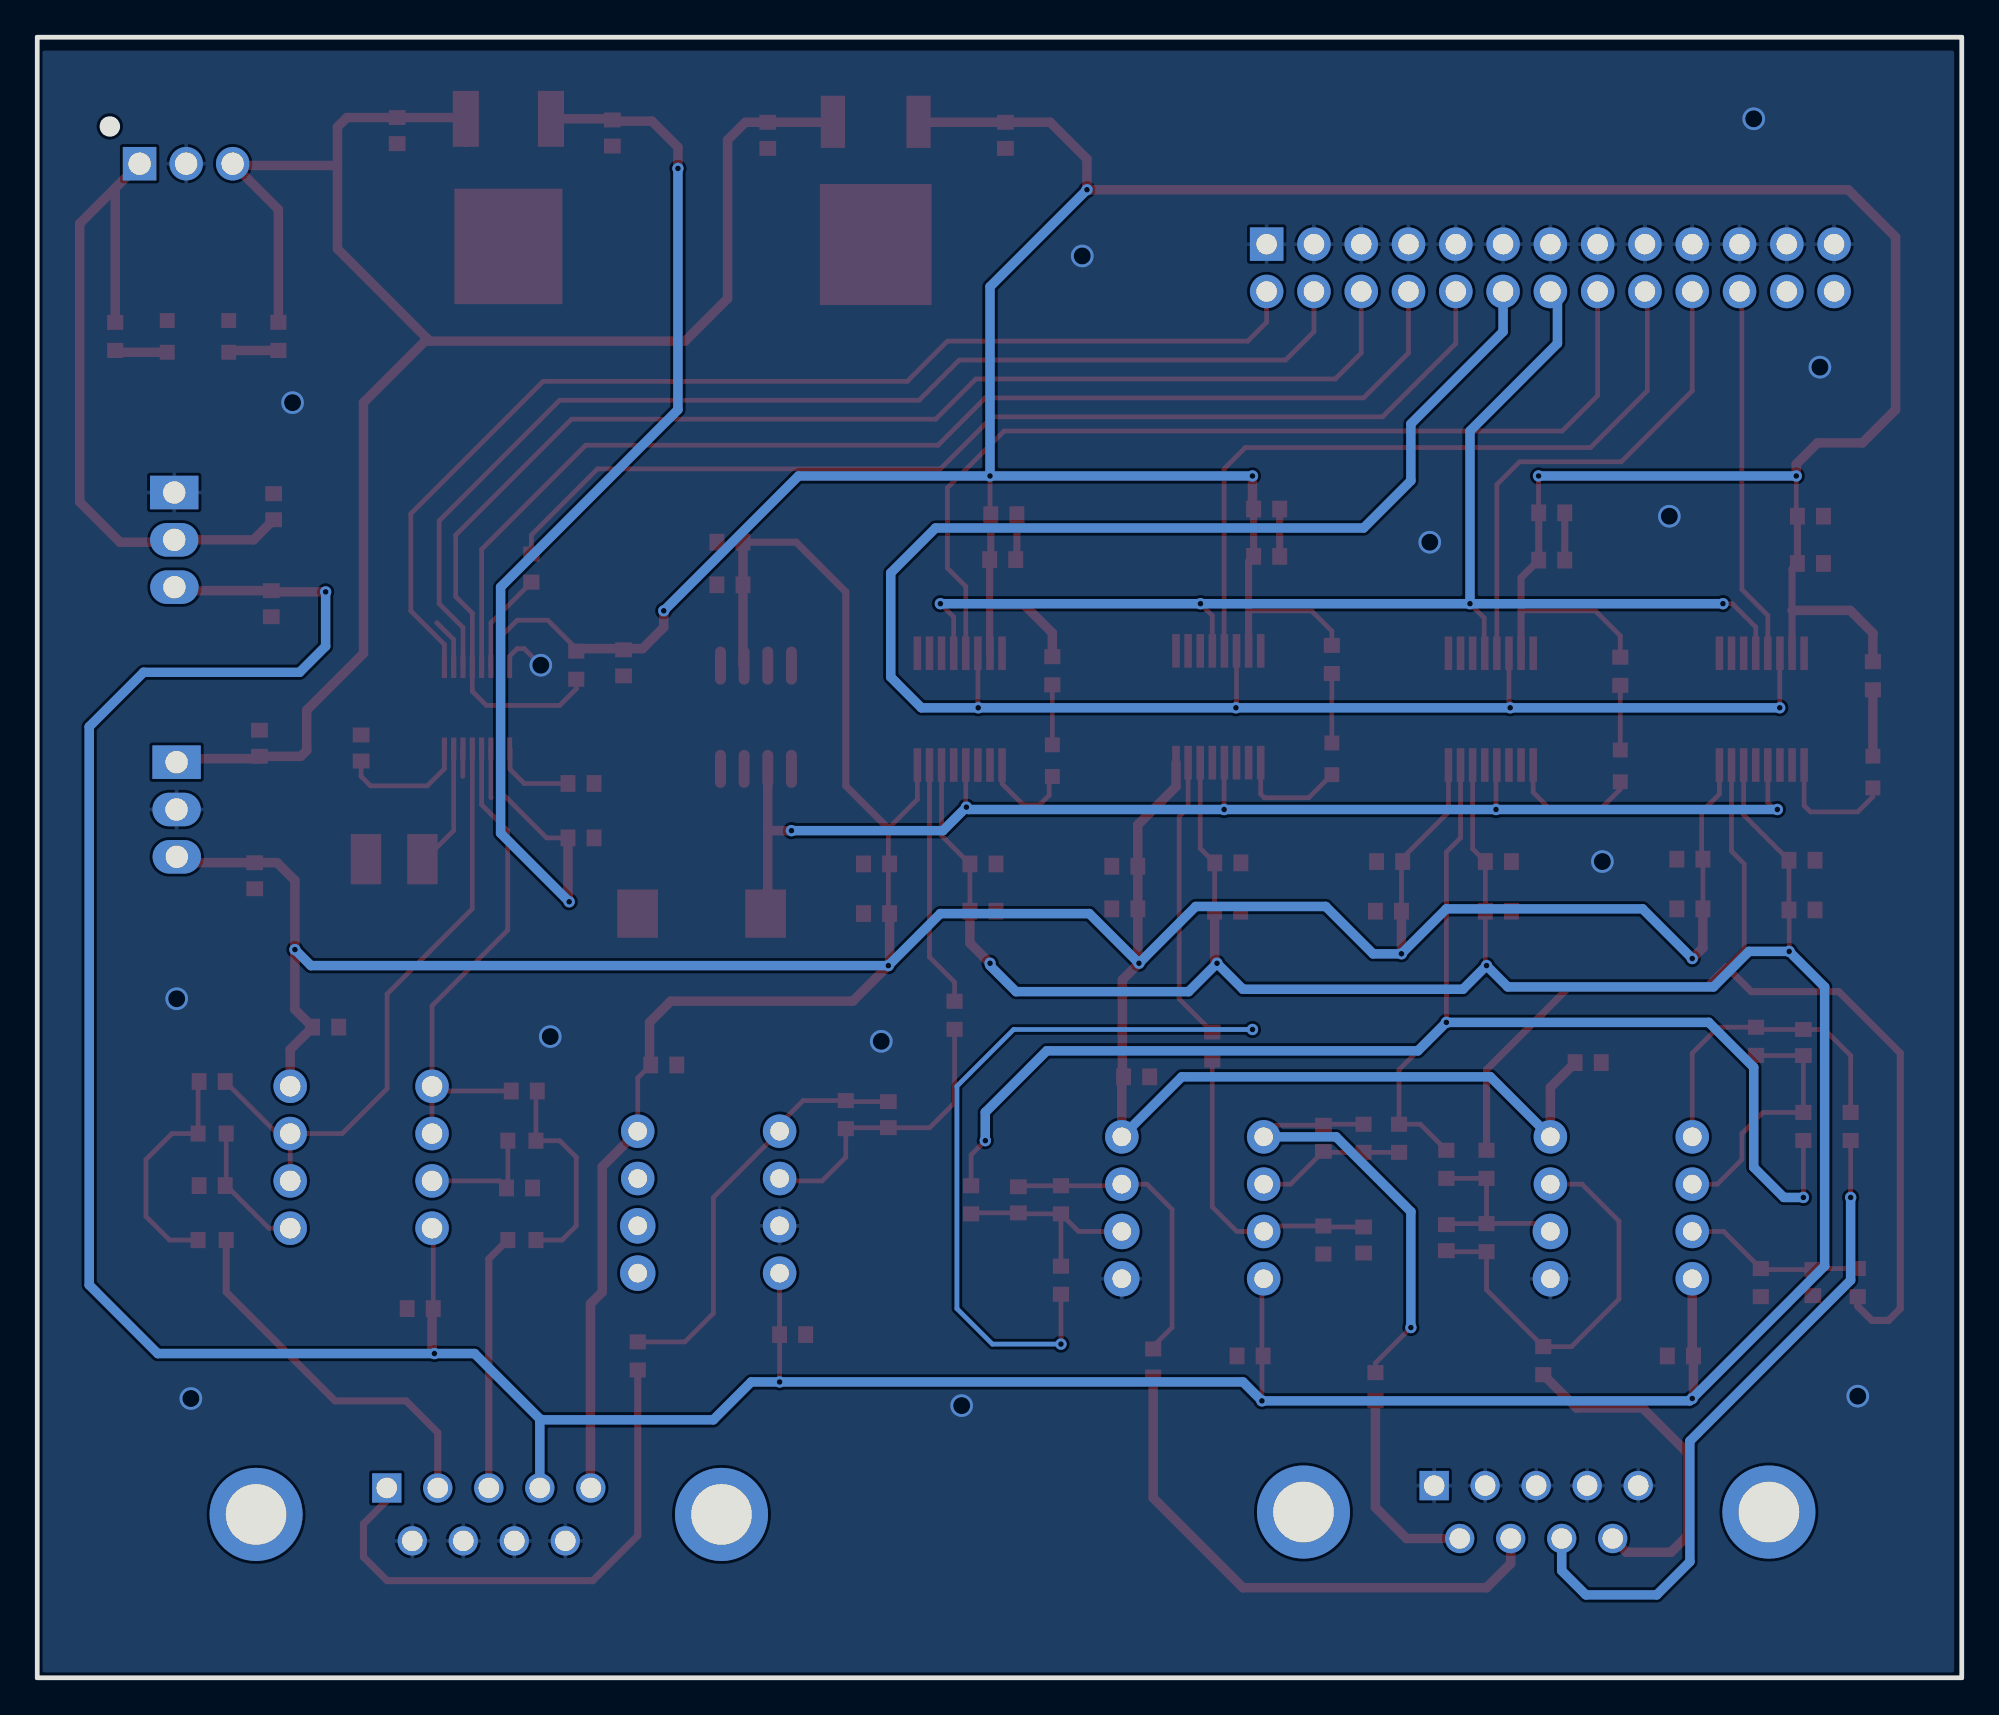
[diagram p4: board, bottom side, seen from below]

Outline 103.38 x 88.08 mm; copper layers: Top Layer, Bottom Layer. Coordinates in mm from the lower left corner of the outline.
Outline path: 0,88.08 103.38,88.08 103.38,0 0,0 0,88.08
Stack: SUBSTRATE1 0.32mm FR-4 er 4.8 / Bottom Layer 0.035mm

## Design rules (mm)
spacing safeClearance (default): track to track 0.152, other pairs 0.152 to 0.3
track width trackWidth (default): min 0.127, default 0.254, max 2.54
differential pair differentialPair (default): width min 0.127, default 0.254, max 2.54; gap min 0.152, default 0.152
via viaSize (default): diameter min 0.5, default 0.61, max 10; hole min 0.3, default 0.305, max 6

## Placement (name value [footprint] x y rotation side)
C1  100nF  [C0603]  8.58 41.22 180 top
C2  10uF  [C0603]  8.58 43.89 180 top
C3  100nF  [C0603]  14.61 41.28 180 top
C4  10uF  [C0603]  14.61 43.95 180 top
C5  100nF  [C0603]  8.13 59.82 180 top
C6  10uF  [C0603]  8.13 62.36 180 top
C7  100nF  [C0603]  39.43 41.15 180 top
C8  10uF  [C0603]  39.42 43.75 180 top
C9  100nF  [C0603]  44.96 41.28 180 top
C10  10uF  [C0603]  44.96 43.57 180 top
C11  100nF  [C0603]  37.34 60.2 180 top
C12  10uF  [C0603]  37.34 62.74 180 top
C13  100nF  [C0603]  24.89 41.15 180 top
C14  10uF  [C0603]  24.89 43.82 180 top
C15  100nF  [C0603]  30.8 41.15 180 top
C16  10uF  [C0603]  30.73 43.82 180 top
C17  100nF  [C0603]  22.03 60 180 top
C18  10uF  [C0603]  22.03 62.54 180 top
C19  100nF  [C0603]  52.58 41.15 180 top
C20  10uF  [C0603]  52.58 43.69 180 top
C21  100nF  [C0603]  58.29 41.03 180 top
C22  10uF  [C0603]  58.29 43.69 180 top
C23  100nF  [C0603]  51.52 60.03 180 top
C24  10uF  [C0603]  51.46 62.45 180 top
C25  10uF  [C0603]  66.17 58.68 180 top
C26  100nF  [C0603]  66.17 60.97 180 top
C27  3.3nF  [C0603]  77.22 31.5 0 top
C28  3.3nF  [C0603]  77.47 26.3 0 top
C29  3.3nF  [C0603]  93.98 32.01 180 top
C30  3.3nF  [C0603]  93.98 26.42 180 top
C31  100nF  [C0603]  85.98 49.92 270 top
C32  2.2uF  [C0603]  74.17 48.01 180 top
C33  10uF  [C0603]  74.17 45.09 180 top
C34  100nF  [C0603]  62.8 18.42 180 top
C35  100nF  [C0603]  69.72 32.9 0 top
C36  100nF  [C0603]  87.88 34.93 0 top
C37  4.7nF  [C0603]  27.69 23.63 270 top
C38  4.7nF  [C0603]  8.51 34.1 90 top
C39  4.7nF  [C0603]  8 21.22 90 top
C40  4.7nF  [C0603]  50.67 25.66 270 top
C41  4.7nF  [C0603]  34.29 28.96 270 top
C42  4.7nF  [C0603]  32.13 23.5 270 top
C43  100nF  [C0603]  20.07 33.03 0 top
C44  100nF  [C0603]  15.11 17.28 0 top
C45  100nF  [C0603]  38.23 17.28 0 top
C46  100nF  [C0603]  44.32 32.26 0 top
C47  100nF  [C0603]  82.8 19.82 0 top
C48  4.7nF  [C0603]  57.66 30.23 90 top
C49  0.33uF  [C0603]  84.04 83.06 270 top
C50  100nF  [C0603]  72.48 82.94 90 top
C51  100nF  [C0603]  71.88 54.49 270 top
C54  100uF  [CAP-SMD_L7.3-W4.3-FD]  67.69 41.03 0 top
C55  47uF  [C1210]  84.2 43.95 0 top
C56  0.33uF  [C0603]  91.44 50.17 90 top
C57  100nF  [C0603]  91.69 43.06 90 top
C58  1uF  [C0603]  51.37 82.81 90 top
C60  4.7uF  [C0603]  64.14 82.81 270 top
C61  2.2uF  [C0603]  90.68 62.87 90 top
C62  1uF  [C0603]  90.8 57.66 90 top
DSUB1  RDED-9SE-LNA(4-40)(55)  [DSUB-TH_9P-P2.74-S2.84_L18.5-W30.8-M]  22.86 8.9 0 top
DSUB2  RDED-9SE-LNA(4-40)(55)  [DSUB-TH_9P-P2.74-S2.84_L18.5-W30.8-M]  79.12 8.77 0 top
H1  10897262  [HDR-TH_26P-P2.54-V-M-R2-C13-S2.54]  22.1 75.7 180 top
LED1  19-217/R6C-AL1M2VY/3T  [LED0603-R-RD]  4.77 48.63 90 top
LED2  19-217/R6C-AL1M2VY/3T  [LED0603-R-RD]  33.84 49.34 90 top
LED3  19-217/R6C-AL1M2VY/3T  [LED0603-R-RD]  18.34 48.96 90 top
LED4  19-217/R6C-AL1M2VY/3T  [LED0603-R-RD]  48.85 49.24 90 top
LED5  19-217/R6C-AL1M2VY/3T  [LED0603-R-RD]  93.09 72.02 270 top
LED6  19-217/R6C-AL1M2VY/3T  [LED0603-R-RD]  96.39 72.02 90 top
R1  10k  [R0603]  4.77 53.8 270 top
R2  10k  [R0603]  33.84 54.67 270 top
R3  10k  [R0603]  18.34 54.04 270 top
R4  10k  [R0603]  48.85 54.06 270 top
R5  3k  [R0603]  25.53 23.63 270 top
R6  220  [R0603]  22.48 17.02 270 top
R7  3k  [R0603]  25.53 27.57 270 top
R8  3k  [R0603]  27.69 27.57 270 top
R9  220  [R0603]  5.97 29.6 270 top
R10  3k  [R0603]  11.05 34.17 90 top
R11  3k  [R0603]  10.8 21.22 90 top
R12  3k  [R0603]  5.59 21.22 90 top
R13  3k  [R0603]  8.51 29.6 90 top
R14  220  [R0603]  43.43 16.9 90 top
R15  3k  [R0603]  48.39 25.66 270 top
R16  3k  [R0603]  48.39 21.34 270 top
R17  3k  [R0603]  53.21 25.66 90 top
R18  3k  [R0603]  32.13 28.96 270 top
R19  220  [R0603]  31.5 15.63 90 top
R20  3k  [R0603]  34.29 23.5 270 top
R21  3k  [R0603]  40.26 33.92 90 top
R22  3k  [R0603]  30.23 28.96 90 top
R23  470  [R0603]  77.34 23.5 180 top
R24  470  [R0603]  77.34 28.84 0 top
R25  470  [R0603]  93.98 23.5 0 top
R26  470  [R0603]  93.98 29.22 180 top
R27  10k  [R0603]  90.42 72.02 270 top
R28  100  [R0603]  76.83 59.58 90 top
R29  10K  [R0603]  74.42 54.36 90 top
R30  3k  [R0603]  54.1 35.57 270 top
R31  3k  [R0603]  59.94 30.23 90 top
R32  220  [R0603]  71.12 17.28 270 top
R33  10k  [R0603]  99.19 72.02 90 top
U1  AD5761RBRUZ  [TSSOP-16_L5.0-W4.4-P0.65-LS6.4-TL]  10.74 52 90 top
U2  AD5761RBRUZ  [TSSOP-16_L5.0-W4.4-P0.65-LS6.4-TL]  39.93 52.13 90 top
U3  AD5761RBRUZ  [TSSOP-16_L5.0-W4.4-P0.65-LS6.4-TL]  25.3 52 90 top
U4  AD5761RBRUZ  [TSSOP-16_L5.0-W4.4-P0.65-LS6.4-TL]  53.82 52 90 top
U5  ADR421BRZ-REEL  [SOIC-8_L4.9-W3.9-P1.27-LS6.0-BL]  64.77 51.57 180 top
U9  OPA2227P  [PDIP-8_L9.6-W6.4-P2.54-LS7.6-BL]  18.29 25.23 270 top
U10  OPA2227P  [PDIP-8_L9.6-W6.4-P2.54-LS7.6-BL]  41.31 25.23 270 top
U13  OPA2227P  [PDIP-8_L9.6-W6.4-P2.54-LS7.6-BL]  67.31 25.53 270 top
U15  LTC2326HMS-16#PBF  [MSOP-16_L4.0-W3.0-P0.50-LS4.9-BL]  79.76 52.08 0 top
U16  BD733L5FP-CE2  [TO-252-3L_L6.6-W6.1-P4.60-LS9.5-BR-CW]  58.34 80.24 90 top
U17  SL7815  [TO-220-3_L10.0-W4.5-P2.54-L]  95.89 46.62 270 top
U18  L7915CV  [TO-220-3_L10.0-W4.5-P2.54-L]  96.01 61.09 270 top
U19  B3B-XH-AM(LF)(SN)  [CONN-TH_3P-P2.50_B3B-XH-AM-LF-SN]  95.38 81.29 180 top
U21  LT1469IN8#PBF  [PDIP-8_L10.2-W6.5-P2.54-LS7.6-BL]  85.98 27.95 270 top
U22  MC7805CDTG  [DPAK_L6.6-W6.2-P2.29-LS9.7-BR]  78.07 80.27 90 top

## Footprints (pads in the part's own frame, mm; a bottom-side part is the same pattern mirrored in y, then rotated)
C0603
  rect 0.8x0.9 smd: 1(-0.7,0) 2(0.7,0)
C1210
  rect 1.635x2.7 smd: 1(-1.518,0) 2(1.518,0)
CAP-SMD_L7.3-W4.3-FD
  rect 2.185x2.592 smd: 1(-3.437,0) 2(3.437,0)
CONN-TH_3P-P2.50_B3B-XH-AM-LF-SN
  rect 1.8x1.8 hole 1.2: 1(-2.5,0)
  round 1.8 hole 1.2: 2(0,0) 3(2.5,0)
DPAK_L6.6-W6.2-P2.29-LS9.7-BR
  rect 3x1.4 smd: 1(3.424,-2.286) 3(3.424,2.286)
  rect 6.2x5.8 smd: 2(-3.424,0)
DSUB-TH_9P-P2.74-S2.84_L18.5-W30.8-M
  round 5 hole 3.25: 0(-12.5,0) 0(12.5,0)
  rect 1.575x1.575 hole 1.1: 1(5.48,1.42)
  round 1.575 hole 1.1: 2(2.74,1.42) 3(0,1.42) 4(-2.74,1.42) 5(-5.48,1.42) 6(4.11,-1.42) 7(1.37,-1.42) 8(-1.37,-1.42) 9(-4.11,-1.42)
HDR-TH_26P-P2.54-V-M-R2-C13-S2.54
  rect 1.8x1.8 hole 1.1: 1(-15.24,-1.27)
  round 1.8 hole 1.1: 2(-15.24,1.27) 3(-12.7,-1.27) 4(-12.7,1.27) 5(-10.16,-1.27) 6(-10.16,1.27) 7(-7.62,-1.27) 8(-7.62,1.27) 9(-5.08,-1.27) 10(-5.08,1.27) 11(-2.54,-1.27) 12(-2.54,1.27) 13(0,-1.27) 14(0,1.27) 15(2.54,-1.27) 16(2.54,1.27) 17(5.08,-1.27) 18(5.08,1.27) 19(7.62,-1.27) 20(7.62,1.27) 21(10.16,-1.27) 22(10.16,1.27) 23(12.7,-1.27) 24(12.7,1.27) 25(15.24,-1.27) 26(15.24,1.27)
LED0603-R-RD
  rect 0.8x0.8 smd: 1(0.851,0) 2(-0.851,0)
MSOP-16_L4.0-W3.0-P0.50-LS4.9-BL
  rect 0.28x1.2 smd: 1(-1.75,-2.197) 2(-1.25,-2.197) 3(-0.75,-2.197) 4(-0.25,-2.197) 5(0.25,-2.197) 6(0.75,-2.197) 7(1.25,-2.197) 8(1.75,-2.197) 9(1.75,2.197) 10(1.25,2.197) 11(0.75,2.197) 12(0.25,2.197) 13(-0.25,2.197) 14(-0.75,2.197) 15(-1.25,2.197) 16(-1.75,2.197)
PDIP-8_L9.6-W6.4-P2.54-LS7.6-BL
  round 1.8 hole 1: 1(-3.81,-3.81) 2(-1.27,-3.81) 3(1.27,-3.81) 4(3.81,-3.81) 7(-1.27,3.81) 8(-3.81,3.81)
  round 1.905 hole 1: 5(3.81,3.81) 6(1.27,3.81)
PDIP-8_L10.2-W6.5-P2.54-LS7.6-BL
  round 1.8 hole 1.1: 1(-3.81,-3.81) 2(-1.27,-3.81) 3(1.27,-3.81) 4(3.81,-3.81) 5(3.81,3.81) 6(1.27,3.81) 7(-1.27,3.81) 8(-3.81,3.81)
R0603
  rect 0.807x0.864 smd: 1(-0.754,0) 2(0.754,0)
SOIC-8_L4.9-W3.9-P1.27-LS6.0-BL
  oval 0.588x2.045 smd: 1(-1.905,-2.772) 2(-0.635,-2.772) 3(0.635,-2.772) 4(1.905,-2.772) 5(1.905,2.772) 6(0.635,2.772) 7(-0.635,2.772) 8(-1.905,2.772)
TO-220-3_L10.0-W4.5-P2.54-L
  rect 1.8x2.6 hole 1.2: 1(-2.54,0.005)
  oval 1.8x2.6 hole 1.2: 2(0,0.005) 3(2.54,-0.005)
TO-252-3L_L6.6-W6.1-P4.60-LS9.5-BR-CW
  rect 2.8x1.3 smd: 1(3.292,-2.3) 3(3.292,2.3)
  rect 6.5x6 smd: 2(-3.292,0)
TSSOP-16_L5.0-W4.4-P0.65-LS6.4-TL
  rect 1.804x0.406 smd: 1(-3,2.275) 2(-3,1.625) 3(-3,0.975) 4(-3,0.325) 5(-3,-0.325) 6(-3,-0.975) 7(-3,-1.625) 8(-3,-2.275) 9(3,-2.275) 10(3,-1.625) 11(3,-0.975) 12(3,-0.325) 13(3,0.325) 14(3,0.975) 15(3,1.625) 16(3,2.275)

## Nets
As in the schematic.

Pads without a net: DSUB1 0; DSUB2 0; H1 24 26; U1 2 3 9 10 11; U2 2 3 9 10 11; U3 2 3 9 10 11; U4 2 3 9 10 11; U5 1 3 5 7 8; U13 5 6 7

## Via types
v1: diameter 1.219, hole 0.914, Top Layer to Bottom Layer, 14 vias
v2: diameter 0.61, hole 0.305, Top Layer to Bottom Layer, 42 vias

## Routing (per net, layer and track width the routed paths; a pad name or vN(x,y) marks a point on that pad's centre or on a via; arc(x,y) is an arc through that point)
3.3V: length 214.4
  Top Layer w0.254: U15.15 78.51,55.87 77.6,56.78 75.95,56.78 74.42,55.25 R29.2 ; v2(8.89,64.52) 8.89,62.43 C6.1 ; v2(52.2,64.52) 52.2,62.49 C24.1 ; v2(22.73,64.52) 22.73,62.55 C18.1 ; 23.67,57.27 23.66,57.28 19.69,57.28 18.34,55.94 R3.1 ; R2.1 33.84,56.19 34.92,57.28 38.28,57.28 38.31,57.31
  Top Layer w0.381: C18.1 C17.1 23.67,59.06 23.67,55 ; 52.2,55 52.22,55.02 C23.1 52.16,60.09 C24.1 ; C6.1 C5.1 9.12,59.54 9.12,55 ; 38.31,55.13 38.31,59.94 C11.1 C12.1
  Top Layer w0.508: 9.12,57.31 5.99,57.31 4.77,56.09 R1.1 ; v2(69.72,57.28) 69.72,56.39 70.87,55.25 74.42,55.25 ; U16.3 56.01,83.51 C58.2 48.96,83.51 46.99,81.54 v2(46.99,79.89) 6.1,79.89 3.56,77.35 3.56,68.08 5.33,66.3 7.75,66.3 8.89,65.16 v2(8.89,64.52) ; 52.22,57.61 50.36,57.61 48.85,56.1 R4.1 ; v2(38.1,64.52) 38.1,62.81 C12.1
  Bottom Layer w0.508: v2(52.2,64.52) 52.2,74.68 v2(46.99,79.89) ; v2(52.2,64.52) 62.48,64.52 v2(69.72,57.28) ; v2(52.2,64.52) v2(38.1,64.52) ; v2(8.89,64.52) v2(22.73,64.52)
5V: length 63.9
  Top Layer w0.254: U15.2 78.51,47.59 76.01,45.09 C33.1
  Top Layer w0.508: v2(68.96,81.03) 68.96,82.18 70.36,83.57 72.42,83.57 C50.2 72.55,83.7 75.78,83.7 U22.3 ; v2(74.8,41.66) 74.87,41.73 C33.1
  Bottom Layer w0.508: v2(68.96,81.03) 68.96,68.08 78.49,58.55 78.49,45.35 v2(74.8,41.66)
+15V: length 253.5
  Top Layer w0.254: C35.2 71.12,32.2 U13.8 ; C15.2 30.1,43.95 27.57,46.47 U3.8 ; U4.8 56.1,47.16 57.66,45.6 57.66,41.09 C21.2 ; 13.02,49 13.02,47.44 13.97,46.49 13.97,44.01 C4.2 C3.2
  Top Layer w0.381: C26.2 62.61,60.97 59.94,58.3 59.94,47.89 57.66,45.6
  Top Layer w0.508: U2.8 42.21,47.84 44.26,45.79 C10.2 C9.2 44.26,38.42 v2(44.2,38.36) 45.08,37.47 45.08,32.2 45.12,32.17 U10.8 ; U13.8 73.02,27.44 73.02,20.71 73.66,20.07 73.66,10.21 DSUB2.5 ; C43.2 22.1,31.69 U9.8 ; C35.2 70.48,32.96 70.48,35.19 69.34,36.33 59.56,36.33 v2(57.66,38.23) ; C21.2 57.59,38.3 ; U21.8 89.79,33.73 C36.2 89.54,35.88 v2(89.54,39.09) 89.54,42.81 90.49,43.76 C57.2 95.56,43.76 U17.3 ; v2(30.1,38.87) 30.1,38.87 C15.2 ; 65.4,54.34 65.47,54.4 C25.2 C26.2 ; v2(14.48,38.61) 13.91,39.19 C3.2
  Bottom Layer w0.508: v2(89.54,39.09) 88.67,38.23 v2(57.66,38.23) 54.86,41.03 46.86,41.03 v2(44.2,38.36) 41.15,41.41 34.16,41.41 31.62,38.87 v2(30.1,38.87) 27.69,41.28 17.14,41.28 v2(14.48,38.61) ; U9.8 25.32,32.26 41.89,32.26 U10.8
-15V: length 295
  Top Layer w0.254: v2(37.59,14.87) 37.59,17.21 C45.1 37.59,17.34 37.59,21.33 U10.4 ; 26.27,49 26.27,44.5 C14.1 C13.1 25.59,38.3 v2(25.53,38.23) ; C34.1 v2(63.5,15.88) ; C34.1 63.43,18.36 ; C34.1 U13.4 ; U1.6 11.72,46.32 C2.1 C1.1 9.27,41.21 v2(9.27,39) ; C7.1 40.13,43.74 C8.1 40.91,44.53 U2.6 ; U21.4 82.1,24.07 C47.1 ; C19.1 C20.1 54.8,45.22 U4.6
  Top Layer w0.508: C7.1 40.13,38.49 v2(40.01,38.36) ; C19.1 53.28,39.44 v2(52.2,38.36) ; C47.1 82.17,19.75 82.17,17.53 v2(82.04,17.41) ; v2(87.88,58.3) 90.74,58.3 C62.2 95.82,58.36 96.01,58.55 ; U9.4 14.48,17.34 C44.1 14.41,15.06 v2(14.48,14.99)
  Bottom Layer w0.508: 76.38,13.78 DSUB2.4 ; 76.38,13.78 76.38,13.9 79.88,17.41 v2(82.04,17.41) 96.9,17.41 100.58,21.09 100.58,51.06 97.66,53.98 89.28,53.98 87.88,55.38 v2(87.88,58.3) ; 76.38,13.78 76.31,13.85 67.06,13.85 65.02,15.88 v2(63.5,15.88) 38.61,15.88 v2(37.59,14.87) 14.61,14.87 v2(14.48,14.99) 7.37,22.1 7.37,37.09 v2(9.27,39) 11.43,39 13.33,37.09 24.38,37.09 v2(25.53,38.23) 26.8,36.96 38.61,36.96 v2(40.01,38.36) 41.53,36.84 50.8,36.84 52.2,38.23 v2(52.2,38.36)
AGND: length 17.2
  Top Layer w0.254: 80.52,48.39 80.52,49.87 U15.6 ; U15.16 78.01,54.84 77.6,55.25 77.22,55.25 v1(76.33,54.36) ; U15.10 81.01,55.74 81.92,56.65 ; U15.3 79.01,47.26 78.99,47.25
  Top Layer w0.381: C24.2 50.76,60.09 C23.2 ; C18.2 C17.2 ; C12.2 C11.2
  vias: v1(5.59,15.12) v1(7.62,70.36) v1(11.18,83.7) v1(15.71,62.36) v1(19.3,43.82) v1(28.58,60.97) v1(47.24,76.33) v1(53.72,14.61) v1(58.04,34.17) v1(75.82,34.42) v1(89.66,68.46) v1(95.12,14.99) v1(95.89,36.46)
ADC_BUSY: length 61.7
  Top Layer w0.254: U15.11 80.51,56.38 81.79,57.66 81.79,62.11 75.31,68.59 56.01,68.59 53.85,70.75 36.32,70.75 34.8,72.27 H1.4
ADC_CNV: length 60.9
  Top Layer w0.254: U15.9 81.51,55.48 83.31,57.28 83.31,62.49 76.2,69.6 56.64,69.6 54.48,71.76 38.35,71.76 37.34,72.78 H1.2
ADC_SCK: length 63.8
  Top Layer w0.254: H1.8 29.72,71.13 32.13,68.71 52.45,68.71 54.99,66.17 73.91,66.17 79.51,60.58 U15.13
ADC_SDI: length 71.5
  Top Layer w0.254: H1.6 32.26,71.13 33.65,69.73 52.96,69.73 55.12,67.57 74.68,67.57 80.9,61.35 80.9,58.05 80.01,57.15 U15.12 80.01,52.96 79.25,52.2 75.31,52.2 74.42,53.09 R29.1
ADC_SDO: length 57.7
  Top Layer w0.254: 76.83,60.33 76.83,61.35 73.28,64.9 54.86,64.9 52.07,67.7 31.11,67.7 27.18,71.63 H1.10
BIAS: length 29.4
  Top Layer w0.381: R32.2 71.12,7.63 73.53,5.21 84.58,5.21 85.85,6.48 85.85,8.26 84.6,9.51 DSUB2.1
PREAMP+: length 13.7
  Top Layer w0.381: DSUB2.3 79.12,22.49 78.11,23.5 R23.1
PREAMP-: length 20.3
  Top Layer w0.381: R25.1 93.23,20.71 87.38,14.87 83.57,14.87 81.86,13.16 DSUB2.2
SAMPLE: length 13.2
  Top Layer w0.254: 55.45,49 55.45,38.69 54.1,37.34 R30.1
SCLK: length 108.1
  Top Layer w0.254: 38.96,55.13 38.96,52.11 v2(38.99,52.08) ; v2(9.78,52.08) 9.78,54.99 9.77,55 ; 52.85,55 52.85,52.09 v2(52.83,52.08) ; 24.32,55 24.32,52.14 v2(24.26,52.08)
  Bottom Layer w0.508: H1.12 24.64,72.27 29.59,67.32 29.59,64.27 32.13,61.73 55.12,61.73 57.53,59.32 57.53,53.73 55.88,52.08 v2(52.83,52.08) v2(38.99,52.08) v2(24.26,52.08) v2(9.78,52.08)
SDI: length 73.3
  Top Layer w0.254: 54.15,55 54.15,56.95 v2(54.86,57.66) ; v2(40.89,57.66) 40.26,57.03 U2.12 ; 25.62,55 25.65,55.03 25.65,56.9 v2(26.42,57.66) ; v2(12.83,57.66) 12.32,57.66 11.07,56.41 11.07,55
  Bottom Layer w0.508: v2(54.86,57.66) v2(40.89,57.66) v2(26.42,57.66) ; H1.14 21.72,74.05 21.72,71.63 26.42,66.94 v2(26.42,57.66) ; v2(26.42,57.66) v2(12.83,57.66)
SYNC1: length 20.1
  Top Layer w0.254: 10.42,55 10.42,57.03 11.81,58.43 11.81,74.3 H1.22
SYNC2: length 39.6
  Top Layer w0.254: H1.18 16.89,74.3 16.89,69.09 19.94,66.05 38.48,66.05 39.62,64.9 39.62,55.15 U2.13
SYNC3: length 27
  Top Layer w0.254: H1.20 14.48,69.09 18.29,65.28 23.75,65.28 24.97,64.06 24.97,55
SYNC4: length 51.9
  Top Layer w0.254: H1.16 19.56,68.84 21.46,66.94 51.43,66.94 54.48,63.89 54.48,59.57 53.5,58.59 53.5,55
V++: length 100.6
  Top Layer w0.254: 80.35,83.61 80.35,82.3
  Top Layer w0.508: 82.42,71.89 87.25,76.71 87.25,81.19 ; 82.42,71.89 85.85,68.46 85.85,55 88.9,51.95 88.9,49.79 89.22,49.47 C56.1 91.57,49.34 95.7,49.34 95.89,49.16 ; 82.42,71.89 82.3,71.76 68.58,71.76 66.29,74.05 66.29,82.56 65.34,83.51 C60.1 60.66,83.51 U16.1 ; 87.25,81.19 87.25,83.26 86.74,83.76 C49.1 80.42,83.76 U22.1 ; 87.25,81.19 92.78,81.19 ; R27.1 90.42,78.83 92.78,81.19 ; 92.78,81.19 U19.3
V--: length 38.5
  Top Layer w0.508: R33.2 99.19,79.98 ; 99.19,79.98 U19.1 ; 99.19,79.98 101.09,78.07 101.09,63.13 98.93,60.97 96.14,60.97 U18.2 91.76,61.09 C61.1
VREF1: length 72.6
  Top Layer w0.254: v2(53.47,46.74) 53.5,46.77 U4.4 ; U1.4 10.42,46.99 10.04,46.62 v2(9.91,46.62) ; U3.4 25.02,48.96 v2(25.02,46.62) ; v2(39.62,46.62) 39.62,49.11 U2.4
  Top Layer w0.508: 64.14,48.79 64.14,41.03 C54.1 ; v2(62.86,45.48) 64.13,45.48
  Bottom Layer w0.508: v2(62.86,45.48) 54.73,45.48 v2(53.47,46.74) 53.34,46.62 v2(39.62,46.62) v2(25.02,46.62) v2(9.91,46.62)
XOUT: length 59.4
  Top Layer w0.254: 12.64,38.17 11.68,39.12 11.68,43.69 12.37,44.38 U1.7
  Top Layer w0.381: R7.1 25.53,32.65 21.08,37.09 13.72,37.09 12.64,38.17 11.3,36.84 6.6,36.84 3.3,33.53 3.3,19.82 3.94,19.18 4.83,19.18 5.59,19.95 R12.1
YOUT: length 55.7
  Top Layer w0.254: v2(48.39,17.91) R16.2 ; v2(38.1,34.8) 40.12,34.8 R21.2 42.04,36.45 42.04,46.23 41.56,46.71 U2.7
  Bottom Layer w0.254: v2(38.1,34.8) 50.93,34.8 53.98,31.76 53.98,19.82 52.07,17.91 v2(48.39,17.91)
Z+X: length 18.6
  Top Layer w0.508: R6.2 20.69,14.48 17.14,14.48 14.73,12.07 14.73,7.63 15.62,6.74 18.01,6.74 DSUB1.9
Z+Y: length 29.6
  Top Layer w0.508: DSUB1.7 24.23,6.13 25.53,4.83 38.61,4.83 43.43,9.66 R14.1
Z-X: length 36.1
  Top Layer w0.254: v2(5.97,25.79) R9.2
  Bottom Layer w0.508: DSUB1.8 21.49,5.75 20.19,4.45 16.38,4.45 14.61,6.23 14.61,12.71 5.97,21.34 v2(5.97,25.79)
Z-Y: length 10.9
  Top Layer w0.508: DSUB1.6 29.82,7.48 31.5,9.15 R19.1
ZOUT: length 84.1
  Top Layer w0.254: v2(8.51,25.79) R13.1 ; U3.7 26.92,45.09 27.69,44.33 v2(27.69,35.19) 30.23,32.65 R22.2 29.08,29.72 R8.1 ; v2(52.45,28.84) 53.21,28.07 R17.2
  Bottom Layer w0.508: v2(8.51,25.79) 9.56,25.79 11.18,27.41 11.18,32.77 13.59,35.19 v2(27.69,35.19) 29.21,33.66 49.15,33.66 52.45,30.36 v2(52.45,28.84)
$1N8441: length 6.1
  Top Layer w0.254: 37.66,49.13 37.66,47.44 37.46,47.25 35.07,47.25 LED2.2
$1N8442: length 3.7
  Top Layer w0.254: R2.2 33.84,50.19
$1N8455: length 6.8
  Top Layer w0.254: LED1.2 4.77,47.3 5.59,46.49 8.13,46.49 8.47,46.83 U1.1
$1N8456: length 3.6
  Top Layer w0.508: R1.2 LED1.1
$1N8468: length 5.3
  Top Layer w0.254: LED4.2 49.02,48.22 49.02,47.38 49.53,46.87 50.42,46.87 51.55,48 U4.1
$1N8469: length 3.2
  Top Layer w0.254: R4.2 LED4.1
$1N8482: length 7.3
  Top Layer w0.254: LED3.2 18.34,47.7 19.3,46.74 22.22,46.74 23.02,47.54 23.02,49
$1N8483: length 3.5
  Top Layer w0.254: R3.2 LED3.1
$1N8501: length 22.4
  Top Layer w0.254: C37.2 27.63,22.87 R5.2 25.53,20.83 R6.1 20.96,17.78 18.41,20.33 18.41,24.52 20.4,26.5 U9.7
$1N8502: length 10.4
  Top Layer w0.254: R5.1 25.52,24.39 22.53,24.39 U9.6 ; R5.1 R7.2 R8.2 ; R5.1 27.63,24.38 C37.1
$1N8511: length 16.8
  Top Layer w0.254: R14.2 43.43,17.79 42.42,18.81 42.42,25.15 43.77,26.5 U10.7 45.2,26.41 R15.1 50.62,26.41 C40.1
$1N8512: length 11.3
  Top Layer w0.254: R17.1 53.16,24.96 C40.2 50.62,24.91 R15.2 ; R15.2 47.44,23.96 U10.6 ; R15.2 R16.1
$1N8517: length 24.7
  Top Layer w0.254: R19.2 31.5,16.9 v2(29.59,18.8) ; U10.1 36.88,29.66 C41.1 34.24,29.72 R18.1
  Bottom Layer w0.508: U10.1 33.61,29.04 29.59,25.03 v2(29.59,18.8)
$1N8518: length 8.1
  Top Layer w0.254: U10.2 36.05,26.5 C41.2 34.29,28.21 R18.2 R22.1
$1N8520: length 16.7
  Top Layer w0.254: C42.1 34.24,24.2 R20.1 37.2,24.26 U10.3 38.94,23.96 40.26,25.28 R21.1
$1N8548: length 14
  Top Layer w0.254: R10.1 11.04,33.4 C38.1 R13.2 10.68,30.35 11.81,29.22 11.81,27.82 13.13,26.5 U9.2
$1N8549: length 17.3
  Top Layer w0.254: U9.1 14.48,33.53 13.09,34.92 R10.2 10.93,34.8 C38.2 7.37,34.8 5.97,33.41 R9.1
$1N8550: length 9.9
  Top Layer w0.254: 8.15,21.92 10.74,21.92 R11.2 12.79,23.96 U9.3 ; 8.15,21.92 8.09,21.97 R12.2 ; 8.15,21.92 C39.2
$1N30800: length 16
  Top Layer w0.254: R30.2 54.1,30.87 55.44,29.53 C48.1 59.89,29.53 R31.1 59.94,27.95 61.21,26.68 63.37,26.68 U13.2
$1N31013: length 22.7
  Top Layer w0.254: R32.1 68.59,18.03 67.06,19.56 67.06,25.79 U13.1 63.5,29.72 62.24,30.99 R31.2 59.89,30.93 C48.2
$2N10171: length 11.4
  Top Layer w0.254: C27.1 76.59,31.43 R24.1 75.31,28.84 74.42,27.95 74.42,24.26 75.18,23.5 R23.2
$2N10177: length 27.3
  Top Layer w0.254: U21.1 U21.2 ; U21.1 81.92,31.5 C27.2 ; U21.1 82.17,36.07 78.11,40.14 78.11,45.47 79.51,46.87 U15.4
$2N10196: length 6.7
  Top Layer w0.254: U21.3 78.55,26.68 C28.2 78.1,26.37 R24.2
$2N10488: length 12.6
  Top Layer w0.254: C29.1 94.73,31.96 R26.1 96.14,29.22 97.54,27.82 97.54,24.77 96.27,23.5 R25.2
$2N10490: length 7.3
  Top Layer w0.254: 93.23,26.48 93.23,26.43 90.93,24.14 U21.5 ; 93.23,26.48 C30.2 ; 93.23,26.48 R26.2
$2N12917: length 6.7
  Top Layer w0.254: C55.1 82.54,43.95 81.01,45.49 U15.7
$2N12918: length 7
  Top Layer w0.254: 85.98,49.22 85.98,48.39 85.47,47.89 82.42,47.89 81.51,48.8 U15.8
$2N13335: length 33.5
  Top Layer w0.254: U15.5 80.01,41.29 84.58,36.71 84.58,31.63 86.99,29.22 U21.7 ; U21.7 U21.6 ; U21.7 90.49,29.22 C29.2
$2N14080: length 4.5
  Top Layer w0.254: C32.1 77.22,48.01 77.98,48.77 77.98,49.85 U15.1
$2N15362: length 5.4
  Top Layer w0.254: U15.14 79.01,56.64 76.83,58.81
$3N8511: length 2.7
  Top Layer w0.508: R27.2 92.99,71.26 LED5.1
$3N8729: length 2.8
  Top Layer w0.508: LED6.2 99.09,71.16 R33.1

## Copper pours and planes (outline as drawn; the poured copper is in the pictures)
AGND on Top Layer: 0.51,0.39 103,0.39 103,87.26 0.51,87.26
AGND on Bottom Layer: 0.51,0.39 103,0.39 103,87.26 0.51,87.26

## Text on the board
Top Silkscreen Layer: V++ | V--
